# Altium project Genio350_DevKit.PrjPcb (part 1 of 3)
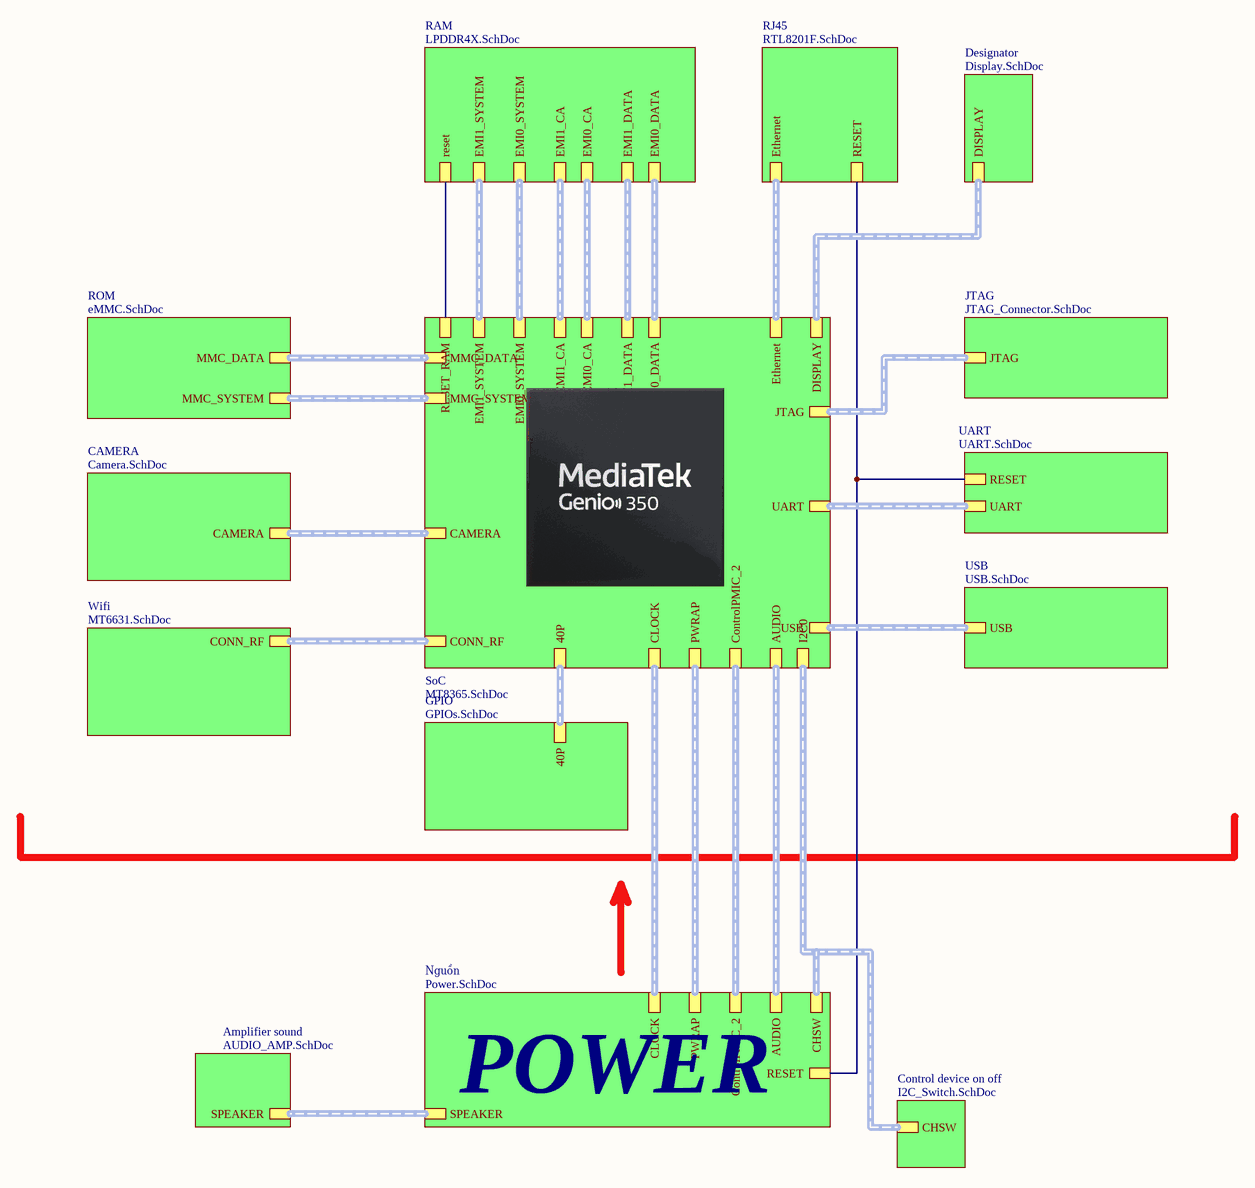
[diagram p0: main.SchDoc]
35 sheets, 543 parts. Net scope: hierarchical (ports join the sheet entries above them; power ports are global).
Board file: DevKit.PcbDoc
Sheets:
  main.SchDoc
    SoC = MT8365.SchDoc
      RAM = MT8365_LPDDR4X.SchDoc
      ROM, SD = MT8365_eMMC.SchDoc
      CAMERA = MT8365_Camera.SchDoc
      Connectivity = MT8365_CONN.SchDoc
      Ground = MT8365_Ground.SchDoc
      Power Soc = MT8365_Power.SchDoc
      Audio = MT8365_AUD.SchDoc
      Other = MT8365_Other.SchDoc
    RAM = LPDDR4X.SchDoc
      Channel A = LPDDR4X_Channel_A.SchDoc
      Channel B = LPDDR4X_Channel_B.SchDoc
      Power RAM = LPDDR4X_Power.SchDoc
      Ground = LPDDR4X_Ground.SchDoc
      Do Not Use = LPDDR4X_other.SchDoc
    ROM = eMMC.SchDoc
    Wifi = MT6631.SchDoc
    JTAG = JTAG_Connector.SchDoc
    UART = UART.SchDoc
    RJ45 = RTL8201F.SchDoc
    Nguồn = Power.SchDoc
      Power supply = Power_Supply.SchDoc
      BUCK = BUCK.SchDoc
      LDO = LDO.SchDoc
      AUD = AU.SchDoc
      RTC & Miscellaneous Features = RTC_Miscellaneous.SchDoc
      Control & Interface Signals = Control_Interface.SchDoc
      Charging and boost = Charger_boost_LDO.SchDoc
    CAMERA = Camera.SchDoc
    USB = USB.SchDoc
    GPIO = GPIOs.SchDoc
    Designator = Display.SchDoc
    Amplifier sound = AUDIO_AMP.SchDoc
    Control device on off = I2C_Switch.SchDoc

## Sheet main.SchDoc: Main Board Schematic
size A3; Author: Nguyễn Hữu Thắng; DrawnBy: Nguyễn Hữu Thắng; SheetNumber: 1; SheetTotal: 35; ENG_APP_DATE: --/--/--; DSN_APP_DATE: --/--/--; CHK_APP_DATE: --/--/--

### Sub-sheets
Amplifier sound = AUDIO_AMP.SchDoc: SPEAKER
CAMERA = Camera.SchDoc: CAMERA
Control device on off = I2C_Switch.SchDoc: CHSW
Designator = Display.SchDoc: DISPLAY
GPIO = GPIOs.SchDoc: 40P
JTAG = JTAG_Connector.SchDoc: JTAG
Nguồn = Power.SchDoc: PWRAP, ControlPMIC_2, CLOCK, AUDIO, CHSW, SPEAKER, RESET
RAM = LPDDR4X.SchDoc: EMI0_DATA, EMI1_DATA, EMI0_CA, EMI1_CA, EMI1_SYSTEM, EMI0_SYSTEM, reset
RJ45 = RTL8201F.SchDoc: Ethernet, RESET
ROM = eMMC.SchDoc: MMC_DATA, MMC_SYSTEM
SoC = MT8365.SchDoc: EMI0_DATA, EMI1_DATA, EMI0_CA, EMI1_CA, EMI0_SYSTEM, EMI1_SYSTEM, MMC_DATA, RESET_RAM, MMC_SYSTEM, PWRAP, ControlPMIC_2, CLOCK, CONN_RF, AUDIO, Ethernet, UART, USB, CAMERA, DISPLAY, 40P, I2C0, JTAG
UART = UART.SchDoc: UART, RESET
USB = USB.SchDoc: USB
Wifi = MT6631.SchDoc: CONN_RF

### Nets
reset: sheet UART/RESET, sheet RJ45/RESET, sheet Nguồn/RESET
NetU1#1_F14: sheet SoC/RESET_RAM, sheet RAM/reset

### Buses and harness runs
harness sheet Amplifier sound/SPEAKER = sheet Nguồn/SPEAKER
harness sheet CAMERA/CAMERA = sheet SoC/CAMERA
harness sheet Control device on off/CHSW = sheet Nguồn/CHSW = sheet SoC/I2C0
harness sheet Designator/DISPLAY = sheet SoC/DISPLAY
harness sheet GPIO/40P = sheet SoC/40P
harness sheet JTAG/JTAG = sheet SoC/JTAG
harness sheet Nguồn/AUDIO = sheet SoC/AUDIO
harness sheet Nguồn/CLOCK = sheet SoC/CLOCK
harness sheet Nguồn/ControlPMIC_2 = sheet SoC/ControlPMIC_2
harness sheet Nguồn/PWRAP = sheet SoC/PWRAP
harness sheet RAM/EMI0_CA = sheet SoC/EMI0_CA
harness sheet RAM/EMI0_DATA = sheet SoC/EMI0_DATA
harness sheet RAM/EMI0_SYSTEM = sheet SoC/EMI0_SYSTEM
harness sheet RAM/EMI1_CA = sheet SoC/EMI1_CA
harness sheet RAM/EMI1_DATA = sheet SoC/EMI1_DATA
harness sheet RAM/EMI1_SYSTEM = sheet SoC/EMI1_SYSTEM
harness sheet RJ45/Ethernet = sheet SoC/Ethernet
harness sheet ROM/MMC_DATA = sheet SoC/MMC_DATA
harness sheet ROM/MMC_SYSTEM = sheet SoC/MMC_SYSTEM
harness sheet SoC/CONN_RF = sheet Wifi/CONN_RF
harness sheet SoC/UART = sheet UART/UART
harness sheet SoC/USB = sheet USB/USB

### Notes on the sheet
- POWER
- THIS DOCUMENT AND THE DATA DISCLOSED HEREIN OR
- HEREWITH IS THE PROPERTY OF ALTIUM LIMITED AND MAY
- DWG NO:
- REVISION
- REV:
- DESCRIPTION
- DATE
- APPROVED
- BE FREELY DISTRIBUTED IN WHOLE. NO RIGHTS ARE
- RESERVED OR EXPRESS OR IMPLIED WARANTEE GIVEN.
- ENG:
- APPROVALS
- PROJECT
- DSN:
- CHK:
- REFERENCE DOCUMENTS
- PROJECT REVISION:
- TITLE
- DOCUMENT REVISION:
- DESIGN ITEM:
- BOM:
- FAB DWG:
- PCB DWG:
- ASSY DWG:
- SCALE:
- A3
- SIZE
- CAGE CODE
- FILE NAME
- DWG NO.
- SHEET
- OF
- REV

## Sheet MT8365.SchDoc
size A3; Author: Nguyễn Hữu Thắng; DrawnBy: Nguyễn Hữu Thắng; SheetNumber: 2; SheetTotal: 35
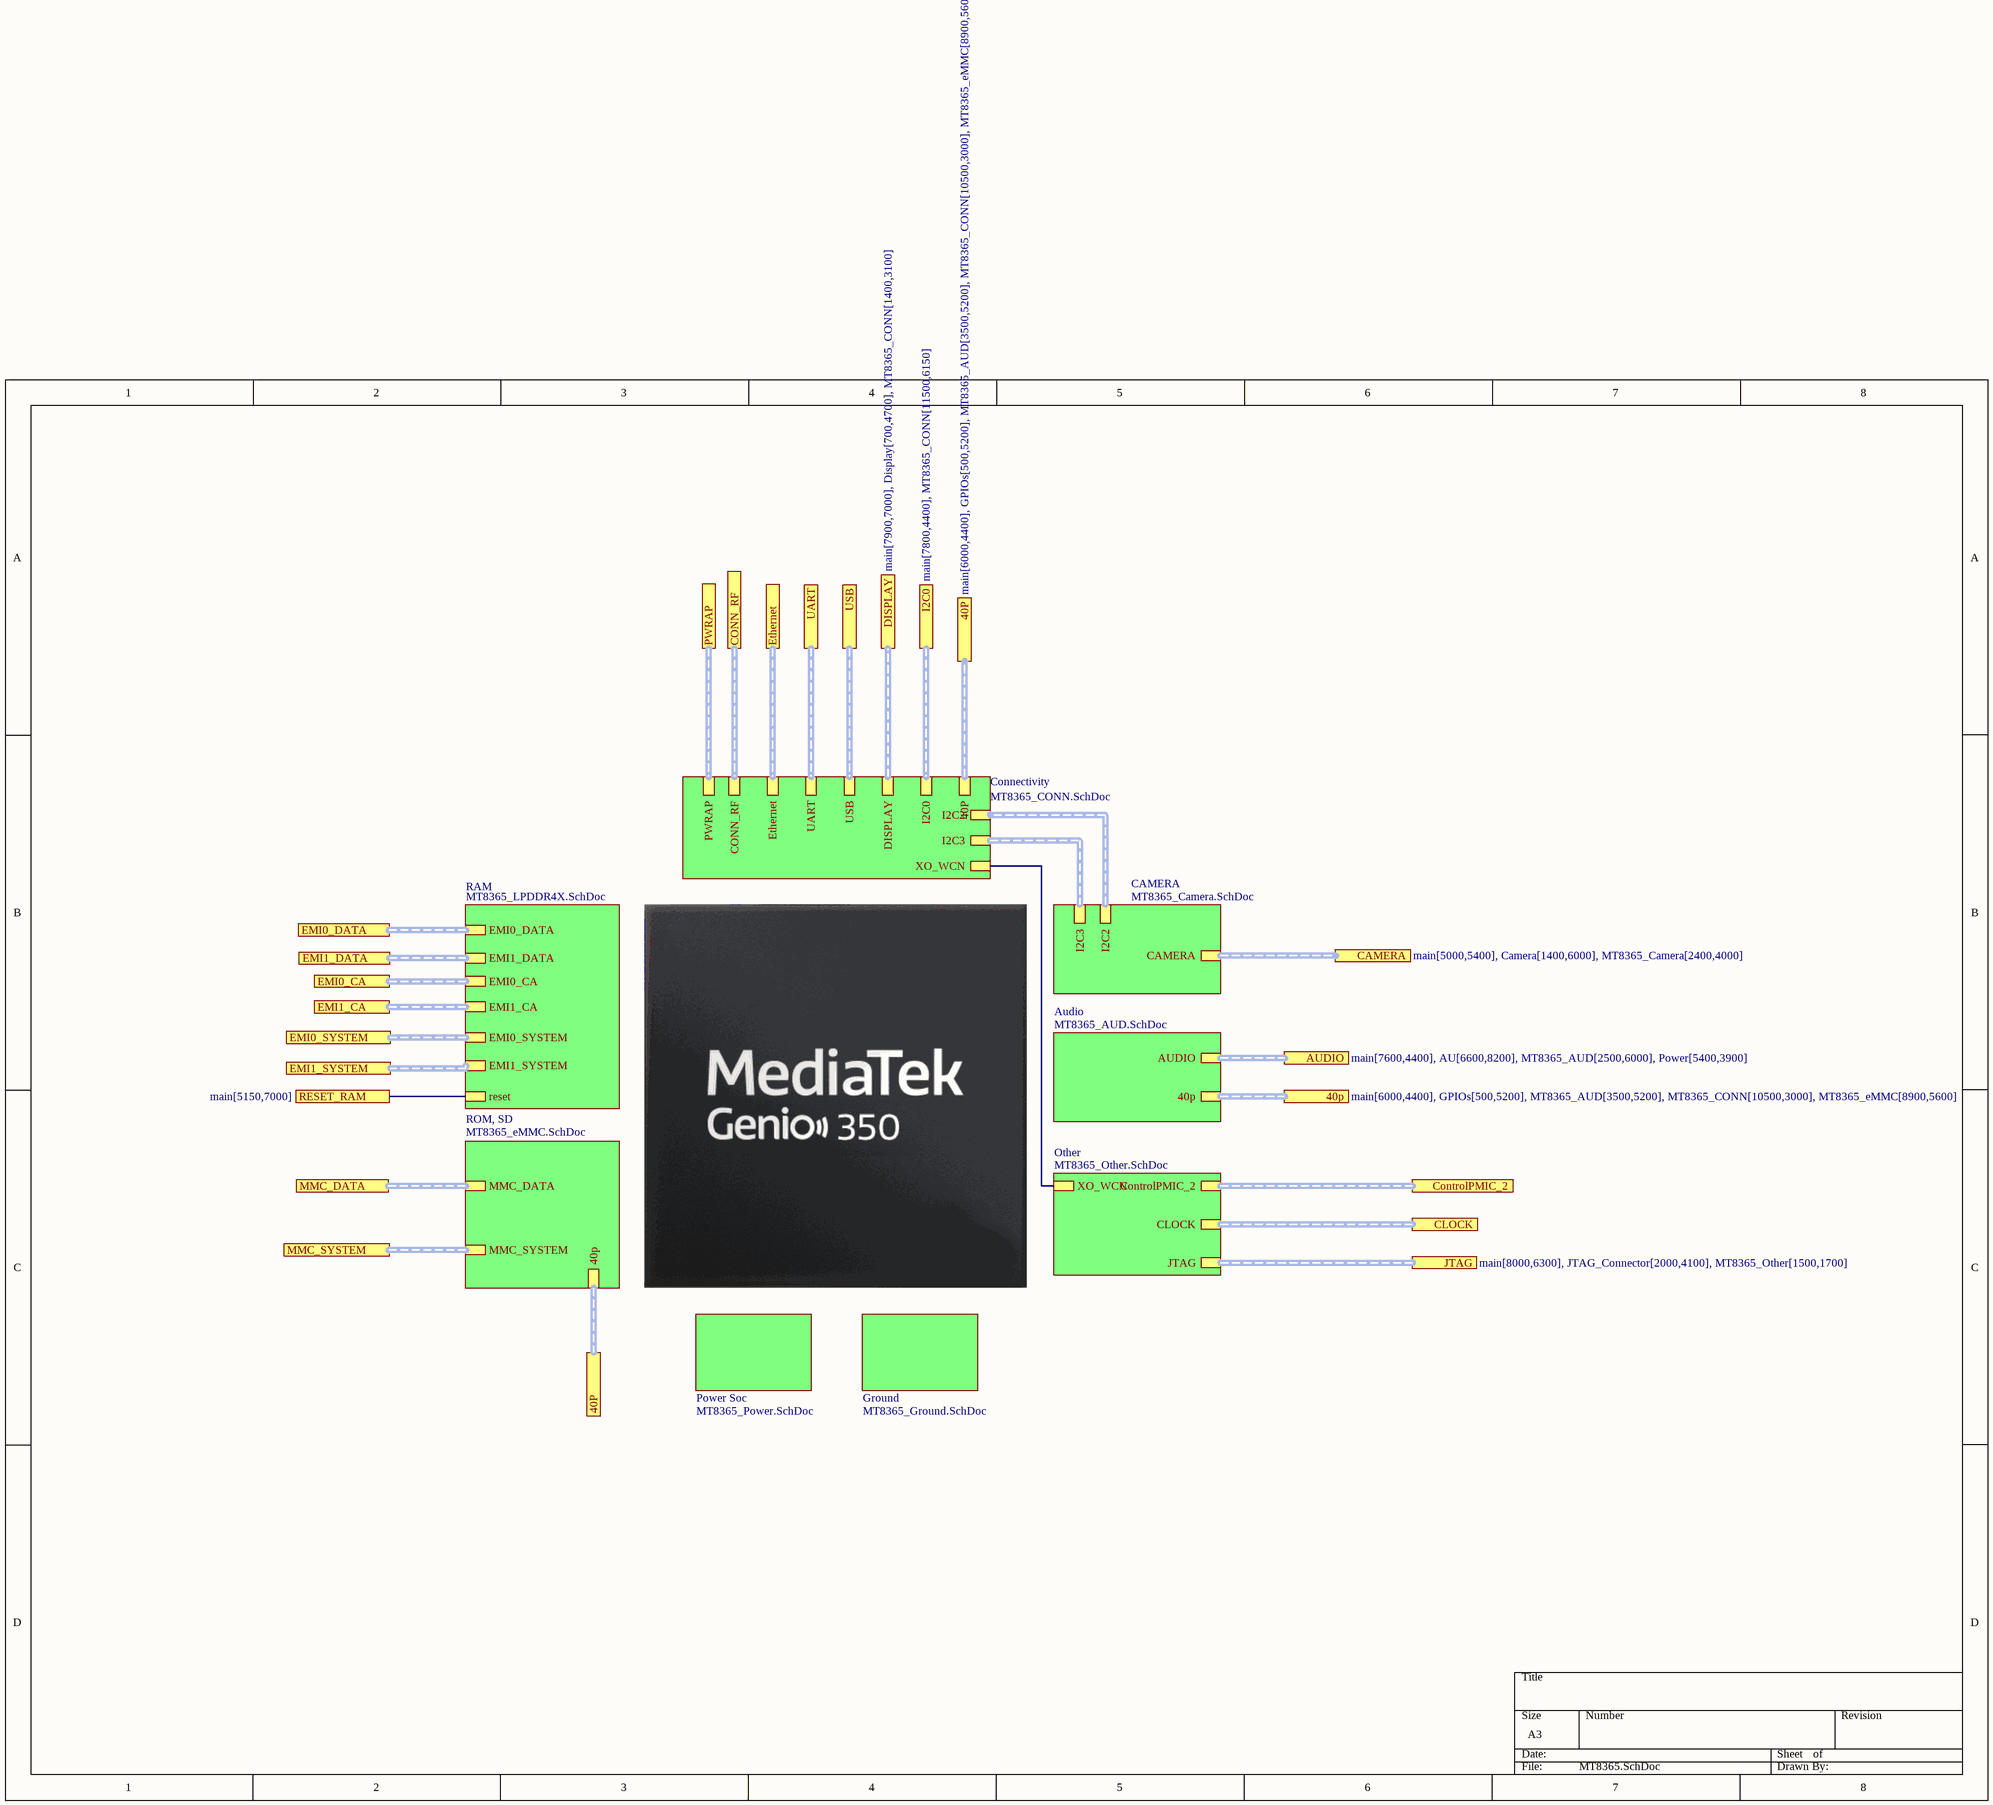
[diagram p1: MT8365.SchDoc]

### Sub-sheets
Audio = MT8365_AUD.SchDoc: AUDIO, 40p
CAMERA = MT8365_Camera.SchDoc: CAMERA, I2C3, I2C2
Connectivity = MT8365_CONN.SchDoc: PWRAP, XO_WCN, CONN_RF, Ethernet, UART, USB, I2C3, I2C2, DISPLAY, 40P, I2C0
Ground = MT8365_Ground.SchDoc: no entries
Other = MT8365_Other.SchDoc: ControlPMIC_2, CLOCK, XO_WCN, JTAG
Power Soc = MT8365_Power.SchDoc: no entries
RAM = MT8365_LPDDR4X.SchDoc: EMI0_DATA, EMI1_DATA, EMI0_CA, EMI1_CA, EMI1_SYSTEM, EMI0_SYSTEM, reset
ROM, SD = MT8365_eMMC.SchDoc: MMC_DATA, MMC_SYSTEM, 40p

### Ports
40P (harness 40p, see main[6000,4400], GPIOs[500,5200], MT8365_AUD[3500,5200], MT8365_CONN[10500,3000], MT8365_eMMC[8900,5600]), 40p (see main[6000,4400], GPIOs[500,5200], MT8365_AUD[3500,5200], MT8365_CONN[10500,3000], MT8365_eMMC[8900,5600]), AUDIO (see main[7600,4400], AU[6600,8200], MT8365_AUD[2500,6000], Power[5400,3900]), CAMERA (see main[5000,5400], Camera[1400,6000], MT8365_Camera[2400,4000]), CLOCK (see main[6700,4400], MT8365_Other[1500,5800], Power[11000,5700], RTC_Miscellaneous[2500,1800]), CONN_RF (see main[5000,4600], MT6631[10400,3000], MT8365_CONN[700,7400]), ControlPMIC_2 (see main[7300,4400], Control_Interface[3100,2200], MT8365_Other[1000,3700], Power[9700,9000]), DISPLAY (see main[7900,7000], Display[700,4700], MT8365_CONN[1400,3100]), EMI0_CA (see main[6200,7000], LPDDR4X[7000,9400], LPDDR4X_Channel_A[2700,5600], MT8365_LPDDR4X[7500,5500]), EMI0_DATA (see main[6700,7000], LPDDR4X[7000,9820], LPDDR4X_Channel_A[8000,5200], MT8365_LPDDR4X[7800,9200]), EMI0_SYSTEM (see main[5700,7000], LPDDR4X[7000,8860], LPDDR4X_Channel_A[7000,2300], MT8365_LPDDR4X[8200,3000]), EMI1_CA (see main[6000,7000], LPDDR4X[7020,7400], LPDDR4X_Channel_B[2700,5600], MT8365_LPDDR4X[7500,4500]), EMI1_DATA (see main[6500,7000], LPDDR4X[7000,7900], LPDDR4X_Channel_B[8000,5200], MT8365_LPDDR4X[7800,7200]), EMI1_SYSTEM (see main[5400,7000], LPDDR4X[7000,6900], LPDDR4X_Channel_B[7500,1700], MT8365_LPDDR4X[8200,1300]), Ethernet (see main[7600,7000], MT8365_CONN[13494.004,8500], RTL8201F[9500,2400]), I2C0 (see main[7800,4400], MT8365_CONN[11500,6150]), JTAG (see main[8000,6300], JTAG_Connector[2000,4100], MT8365_Other[1500,1700]), MMC_DATA (see main[5000,6700], eMMC[6000,4540], MT8365_eMMC[1884.259,5540]), MMC_SYSTEM (see main[5000,6400], eMMC[5900,3640], MT8365_eMMC[2879.674,1840]), PWRAP (see main[7000,4400], Control_Interface[3900,4400], MT8365_CONN[4500,8700], Power[9100,9000]), RESET_RAM (see main[5150,7000]), UART (see main[8000,5600], MT8365_CONN[11800,6800], UART[1600,5800]), USB (see main[8000,4700], MT8365_CONN[2500,5900], USB[700,4700])

### Nets
XO_IN: sheet Connectivity/XO_WCN, sheet Other/XO_WCN
NetU1#1_F14: port RESET_RAM, sheet RAM/reset

### Buses and harness runs
harness port 40p = sheet Audio/40p
harness port 40P = sheet Connectivity/40P
harness port 40P = sheet ROM, SD/40p
harness port AUDIO = sheet Audio/AUDIO
harness port CAMERA = sheet CAMERA/CAMERA
harness port CLOCK = sheet Other/CLOCK
harness port CONN_RF = sheet Connectivity/CONN_RF
harness port ControlPMIC_2 = sheet Other/ControlPMIC_2
harness port DISPLAY = sheet Connectivity/DISPLAY
harness port EMI0_CA = sheet RAM/EMI0_CA
harness port EMI0_DATA = sheet RAM/EMI0_DATA
harness port EMI0_SYSTEM = sheet RAM/EMI0_SYSTEM
harness port EMI1_CA = sheet RAM/EMI1_CA
harness port EMI1_DATA = sheet RAM/EMI1_DATA
harness port EMI1_SYSTEM = sheet RAM/EMI1_SYSTEM
harness port Ethernet = sheet Connectivity/Ethernet
harness port I2C0 = sheet Connectivity/I2C0
harness port JTAG = sheet Other/JTAG
harness port MMC_DATA = sheet ROM, SD/MMC_DATA
harness port MMC_SYSTEM = sheet ROM, SD/MMC_SYSTEM
harness port PWRAP = sheet Connectivity/PWRAP
harness port UART = sheet Connectivity/UART
harness port USB = sheet Connectivity/USB
harness sheet CAMERA/I2C2 = sheet Connectivity/I2C2
harness sheet CAMERA/I2C3 = sheet Connectivity/I2C3

## Sheet MT8365_LPDDR4X.SchDoc
size A3; SheetNumber: 4; SheetTotal: 35
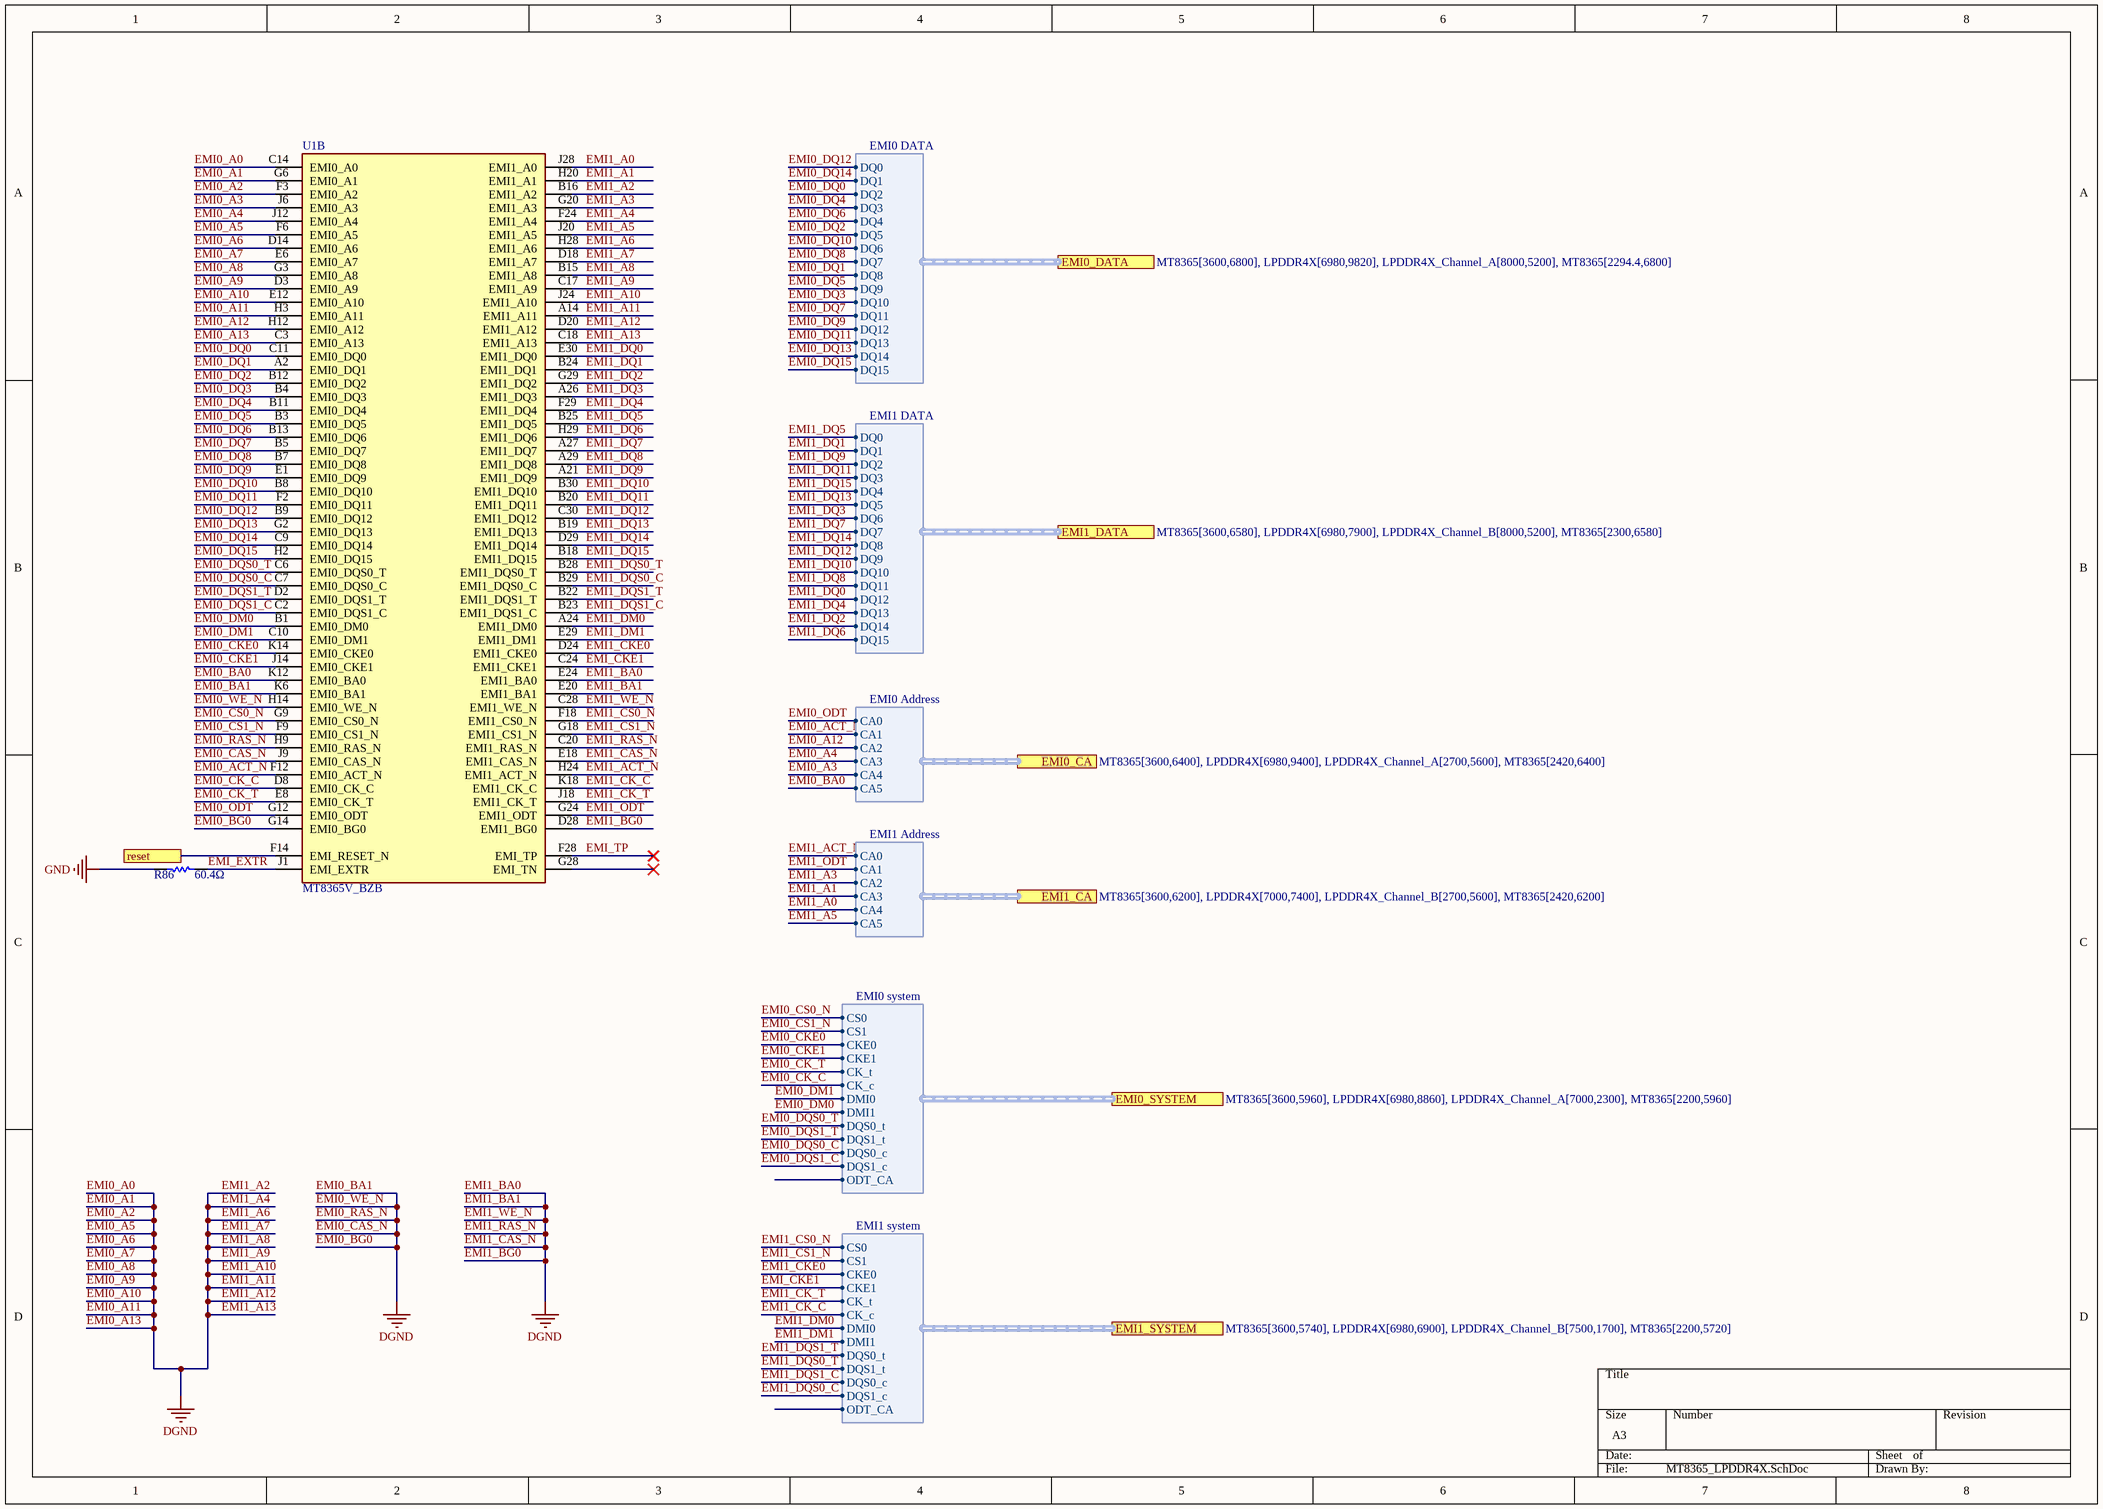
[diagram p2: MT8365_LPDDR4X.SchDoc]

### Parts
(Parts that share a designator on the sheet are numbered #1, #2 ... from top to bottom, then left to right.)
R86  value 60.4Ω  [R0603]  (hidden comment: R0603)
U1#1  MT8365V_BZB  [BGA633C40P30X29_1220X1180X90]  (part B of 11)

### Ports
EMI0_CA (harness EMI0 Address, see MT8365[3600,6400], LPDDR4X[6980,9400], LPDDR4X_Channel_A[2700,5600], MT8365[2420,6400]), EMI0_DATA (harness EMI0 DATA, see MT8365[3600,6800], LPDDR4X[6980,9820], LPDDR4X_Channel_A[8000,5200], MT8365[2294.4,6800]), EMI0_SYSTEM (harness EMI0 system, see MT8365[3600,5960], LPDDR4X[6980,8860], LPDDR4X_Channel_A[7000,2300], MT8365[2200,5960]), EMI1_CA (harness EMI1 Address, see MT8365[3600,6200], LPDDR4X[7000,7400], LPDDR4X_Channel_B[2700,5600], MT8365[2420,6200]), EMI1_DATA (harness EMI1 DATA, see MT8365[3600,6580], LPDDR4X[6980,7900], LPDDR4X_Channel_B[8000,5200], MT8365[2300,6580]), EMI1_SYSTEM (harness EMI1 system, see MT8365[3600,5740], LPDDR4X[6980,6900], LPDDR4X_Channel_B[7500,1700], MT8365[2200,5720]), reset (see MT8365[3600,5500], LPDDR4X[6980,2000], LPDDR4X_other[4080,4900])

### Harnesses
EMI0 DATA: DQ0, DQ1, DQ2, DQ3, DQ4, DQ5, DQ6, DQ7, DQ8, DQ9, DQ10, DQ11, DQ12, DQ13, DQ14, DQ15
EMI1 DATA: DQ0, DQ1, DQ2, DQ3, DQ4, DQ5, DQ6, DQ7, DQ8, DQ9, DQ10, DQ11, DQ12, DQ13, DQ14, DQ15
EMI0 Address: CA0, CA1, CA2, CA3, CA4, CA5
EMI1 Address: CA0, CA1, CA2, CA3, CA4, CA5
EMI0 system: CS0, CS1, CKE0, CKE1, CK_t, CK_c, DMI0, DMI1, DQS0_t, DQS1_t, DQS0_c, DQS1_c, ODT_CA
EMI1 system: CS0, CS1, CKE0, CKE1, CK_t, CK_c, DMI0, DMI1, DQS0_t, DQS1_t, DQS0_c, DQS1_c, ODT_CA

### Nets
EMI0_A0: U1#1.A14(EMI1_A11) U1#1.B15(EMI1_A8) U1#1.B16(EMI1_A2) U1#1.C3(EMI0_A13) U1#1.C14(EMI0_A0) U1#1.C17(EMI1_A9) U1#1.C18(EMI1_A13) U1#1.C20(EMI1_RAS_N) U1#1.C28(EMI1_WE_N) U1#1.D3(EMI0_A9) U1#1.D14(EMI0_A6) U1#1.D18(EMI1_A7) U1#1.D20(EMI1_A12) U1#1.D28(EMI1_BG0) U1#1.E6(EMI0_A7) U1#1.E12(EMI0_A10) U1#1.E18(EMI1_CAS_N) U1#1.E20(EMI1_BA1) U1#1.E24(EMI1_BA0) U1#1.F3(EMI0_A2) U1#1.F6(EMI0_A5) U1#1.F24(EMI1_A4) U1#1.G3(EMI0_A8) U1#1.G6(EMI0_A1) U1#1.G14(EMI0_BG0) U1#1.H3(EMI0_A11) U1#1.H9(EMI0_RAS_N) U1#1.H14(EMI0_WE_N) U1#1.H28(EMI1_A6) U1#1.J9(EMI0_CAS_N) U1#1.J24(EMI1_A10) U1#1.K6(EMI0_BA1)  [also labelled DGND, EMI0_A1, EMI0_A10, EMI0_A11, EMI0_A13, EMI0_A2, EMI0_A5, EMI0_A6, EMI0_A7, EMI0_A8, EMI0_A9, EMI0_BA1, EMI0_BG0, EMI0_CAS_N, EMI0_RAS_N, EMI0_WE_N, EMI1_A10, EMI1_A11, EMI1_A12, EMI1_A13, EMI1_A2, EMI1_A4, EMI1_A6, EMI1_A7, EMI1_A8, EMI1_A9, EMI1_BA0, EMI1_BA1, EMI1_BG0, EMI1_CAS_N, EMI1_RAS_N, EMI1_WE_N]
GND: R86.2
ODT_CA_a: port EMI0_SYSTEM.ODT_CA, port EMI1_SYSTEM.ODT_CA
EMI0_A3: U1#1.J6(EMI0_A3) ; port EMI0_CA.CA4
EMI0_A4: U1#1.J12(EMI0_A4) ; port EMI0_CA.CA3
EMI0_A12: U1#1.H12(EMI0_A12) ; port EMI0_CA.CA2
EMI0_ACT_N: U1#1.F12(EMI0_ACT_N) ; port EMI0_CA.CA1
EMI0_BA0: U1#1.K12(EMI0_BA0) ; port EMI0_CA.CA5
EMI0_CK_C: U1#1.D8(EMI0_CK_C) ; port EMI0_SYSTEM.CK_c  [project net CK_c_a]
EMI0_CK_T: U1#1.E8(EMI0_CK_T) ; port EMI0_SYSTEM.CK_t  [project net CK_t_a]
EMI0_CKE0: U1#1.K14(EMI0_CKE0) ; port EMI0_SYSTEM.CKE0  [project net CKE0_a]
EMI0_CKE1: U1#1.J14(EMI0_CKE1) ; port EMI0_SYSTEM.CKE1  [project net CKE1_a]
EMI0_CS0_N: U1#1.G9(EMI0_CS0_N) ; port EMI0_SYSTEM.CS0  [project net CS0_a]
EMI0_CS1_N: U1#1.F9(EMI0_CS1_N) ; port EMI0_SYSTEM.CS1  [project net CS1_a]
EMI0_DM0: U1#1.B1(EMI0_DM0) ; port EMI0_SYSTEM.DMI1  [project net DMI1_a]
EMI0_DM1: U1#1.C10(EMI0_DM1) ; port EMI0_SYSTEM.DMI0  [project net DMI0_a]
EMI0_DQ0: U1#1.C11(EMI0_DQ0) ; port EMI0_DATA.DQ2
EMI0_DQ1: U1#1.A2(EMI0_DQ1) ; port EMI0_DATA.DQ8
EMI0_DQ2: U1#1.B12(EMI0_DQ2) ; port EMI0_DATA.DQ5
EMI0_DQ3: U1#1.B4(EMI0_DQ3) ; port EMI0_DATA.DQ10
EMI0_DQ4: U1#1.B11(EMI0_DQ4) ; port EMI0_DATA.DQ3
EMI0_DQ5: U1#1.B3(EMI0_DQ5) ; port EMI0_DATA.DQ9
EMI0_DQ6: U1#1.B13(EMI0_DQ6) ; port EMI0_DATA.DQ4
EMI0_DQ7: U1#1.B5(EMI0_DQ7) ; port EMI0_DATA.DQ11
EMI0_DQ8: U1#1.B7(EMI0_DQ8) ; port EMI0_DATA.DQ7
EMI0_DQ9: U1#1.E1(EMI0_DQ9) ; port EMI0_DATA.DQ12
EMI0_DQ10: U1#1.B8(EMI0_DQ10) ; port EMI0_DATA.DQ6
EMI0_DQ11: U1#1.F2(EMI0_DQ11) ; port EMI0_DATA.DQ13
EMI0_DQ12: U1#1.B9(EMI0_DQ12) ; port EMI0_DATA.DQ0
EMI0_DQ13: U1#1.G2(EMI0_DQ13) ; port EMI0_DATA.DQ14
EMI0_DQ14: U1#1.C9(EMI0_DQ14) ; port EMI0_DATA.DQ1
EMI0_DQ15: U1#1.H2(EMI0_DQ15) ; port EMI0_DATA.DQ15
EMI0_DQS0_C: U1#1.C7(EMI0_DQS0_C) ; port EMI0_SYSTEM.DQS0_c  [project net DQS0_c_a]
EMI0_DQS0_T: U1#1.C6(EMI0_DQS0_T) ; port EMI0_SYSTEM.DQS0_t  [project net DQS0_t_a]
EMI0_DQS1_C: U1#1.C2(EMI0_DQS1_C) ; port EMI0_SYSTEM.DQS1_c  [project net DQS1_c_a]
EMI0_DQS1_T: U1#1.D2(EMI0_DQS1_T) ; port EMI0_SYSTEM.DQS1_t  [project net DQS1_t_a]
EMI0_ODT: U1#1.G12(EMI0_ODT) ; port EMI0_CA.CA0
EMI1_A0: U1#1.J28(EMI1_A0) ; port EMI1_CA.CA4
EMI1_A1: U1#1.H20(EMI1_A1) ; port EMI1_CA.CA3
EMI1_A3: U1#1.G20(EMI1_A3) ; port EMI1_CA.CA2
EMI1_A5: U1#1.J20(EMI1_A5) ; port EMI1_CA.CA5
EMI1_ACT_N: U1#1.H24(EMI1_ACT_N) ; port EMI1_CA.CA0
EMI1_CK_C: U1#1.K18(EMI1_CK_C) ; port EMI1_SYSTEM.CK_c  [project net CK_c_b]
EMI1_CK_T: U1#1.J18(EMI1_CK_T) ; port EMI1_SYSTEM.CK_t  [project net CK_t_b]
EMI1_CKE0: U1#1.D24(EMI1_CKE0) ; port EMI1_SYSTEM.CKE0  [project net CKE0_b]
EMI1_CS0_N: U1#1.F18(EMI1_CS0_N) ; port EMI1_SYSTEM.CS0  [project net CS0_b]
EMI1_CS1_N: U1#1.G18(EMI1_CS1_N) ; port EMI1_SYSTEM.CS1  [project net CS1_b]
EMI1_DM0: U1#1.A24(EMI1_DM0) ; port EMI1_SYSTEM.DMI0  [project net DMI0_b]
EMI1_DM1: U1#1.E29(EMI1_DM1) ; port EMI1_SYSTEM.DMI1  [project net DMI1_b]
EMI1_DQ0: U1#1.E30(EMI1_DQ0) ; port EMI1_DATA.DQ12
EMI1_DQ1: U1#1.B24(EMI1_DQ1) ; port EMI1_DATA.DQ1
EMI1_DQ2: U1#1.G29(EMI1_DQ2) ; port EMI1_DATA.DQ14
EMI1_DQ3: U1#1.A26(EMI1_DQ3) ; port EMI1_DATA.DQ6
EMI1_DQ4: U1#1.F29(EMI1_DQ4) ; port EMI1_DATA.DQ13
EMI1_DQ5: U1#1.B25(EMI1_DQ5) ; port EMI1_DATA.DQ0
EMI1_DQ6: U1#1.H29(EMI1_DQ6) ; port EMI1_DATA.DQ15
EMI1_DQ7: U1#1.A27(EMI1_DQ7) ; port EMI1_DATA.DQ7
EMI1_DQ8: U1#1.A29(EMI1_DQ8) ; port EMI1_DATA.DQ11
EMI1_DQ9: U1#1.A21(EMI1_DQ9) ; port EMI1_DATA.DQ2
EMI1_DQ10: U1#1.B30(EMI1_DQ10) ; port EMI1_DATA.DQ10
EMI1_DQ11: U1#1.B20(EMI1_DQ11) ; port EMI1_DATA.DQ3
EMI1_DQ12: U1#1.C30(EMI1_DQ12) ; port EMI1_DATA.DQ9
EMI1_DQ13: U1#1.B19(EMI1_DQ13) ; port EMI1_DATA.DQ5
EMI1_DQ14: U1#1.D29(EMI1_DQ14) ; port EMI1_DATA.DQ8
EMI1_DQ15: U1#1.B18(EMI1_DQ15) ; port EMI1_DATA.DQ4
EMI1_DQS0_C: U1#1.B29(EMI1_DQS0_C) ; port EMI1_SYSTEM.DQS1_c  [project net DQS1_c_b]
EMI1_DQS0_T: U1#1.B28(EMI1_DQS0_T) ; port EMI1_SYSTEM.DQS1_t  [project net DQS1_t_b]
EMI1_DQS1_C: U1#1.B23(EMI1_DQS1_C) ; port EMI1_SYSTEM.DQS0_c  [project net DQS0_c_b]
EMI1_DQS1_T: U1#1.B22(EMI1_DQS1_T) ; port EMI1_SYSTEM.DQS0_t  [project net DQS0_t_b]
EMI1_ODT: U1#1.G24(EMI1_ODT) ; port EMI1_CA.CA1
EMI_CKE1: U1#1.C24(EMI1_CKE1) ; port EMI1_SYSTEM.CKE1  [project net CKE1_b]
EMI_EXTR: R86.1 U1#1.J1(EMI_EXTR)
EMI_TP: U1#1.F28(EMI_TP)
NetU1#1_F14: U1#1.F14(EMI_RESET_N) ; port reset

Not connected (* = marked no-connect by the designer): U1#1 G28(EMI_TN)*

### Library data of the parts
U1#1 = MT8365V_BZB: Integrated Circuit; Manufacturer_Name: Mediatek; Manufacturer_Part_Number: MT8365V/BZB; Datasheet Link: https://www.mouser.co.uk/datasheet/2/1074/MT8365_AIoT_Application_Processor_Datasheet_v1_0_2-3106631.pdf; Height: 0.9mm; Mouser Part Number: 840-MT8365V/BZB; Mouser Price/Stock: https://www.mouser.co.uk/ProductDetail/MediaTek/MT8365V-BZB?qs=Jm2GQyTW%2FbjcedX9ugwNWQ%3D%3D

## Sheet MT8365_eMMC.SchDoc
size A4; SheetNumber: 5; SheetTotal: 35
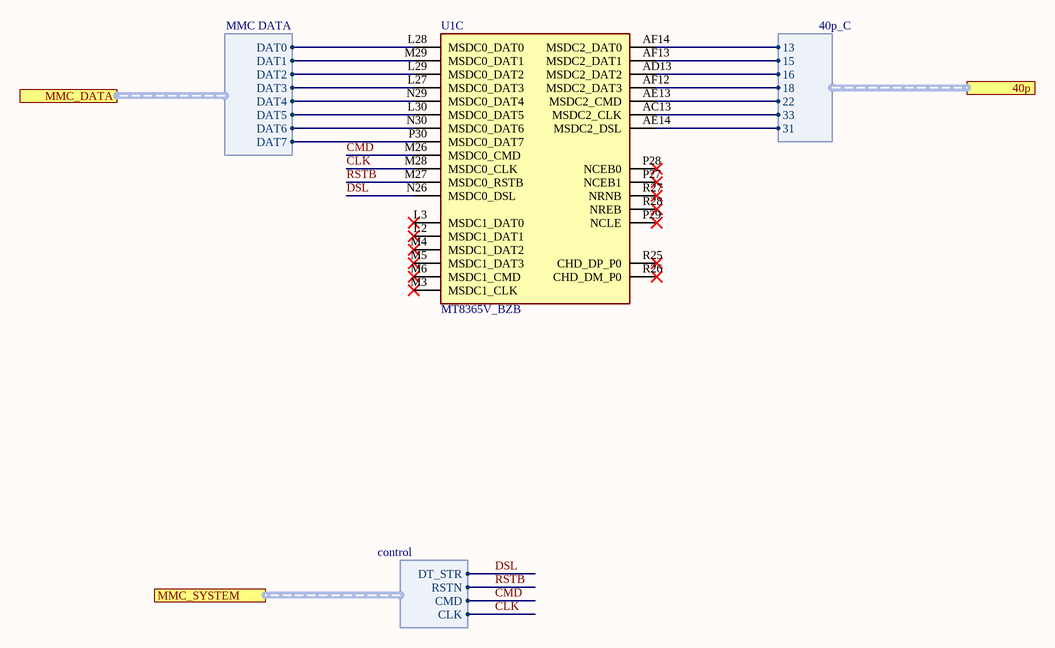
[diagram p3: MT8365_eMMC.SchDoc]

### Parts
(Parts that share a designator on the sheet are numbered #1, #2 ... from top to bottom, then left to right.)
U1#2  MT8365V_BZB  [BGA633C40P30X29_1220X1180X90]  (part C of 10)

### Ports
40p (harness 40p_C, see MT8365[4600,4000], GPIOs[500,5200], MT8365[4600,3000], MT8365[7500,8900], MT8365[10000,5500], MT8365_AUD[3500,5200], MT8365_CONN[10500,3000]), MMC_DATA (harness MMC DATA, see MT8365[3600,4800], eMMC[6000,4540], MT8365[2280,4800]), MMC_SYSTEM (harness control, see MT8365[3600,4300], eMMC[5900,3640], MT8365[2180,4300])

### Harnesses
MMC DATA: DAT0, DAT1, DAT2, DAT3, DAT4, DAT5, DAT6, DAT7
control: DT_STR, RSTN, CMD, CLK
40p_C: 15, 16, 18, 22, 13, 33, 31

### Nets
CLK: U1#2.M28(MSDC0_CLK) ; port MMC_SYSTEM.CLK
CMD: U1#2.M26(MSDC0_CMD) ; port MMC_SYSTEM.CMD
DSL: U1#2.N26(MSDC0_DSL) ; port MMC_SYSTEM.DT_STR
RSTB: U1#2.M27(MSDC0_RSTB) ; port MMC_SYSTEM.RSTN
NetIC3_A3: U1#2.L28(MSDC0_DAT0) ; port MMC_DATA.DAT0
NetIC3_A4: U1#2.M29(MSDC0_DAT1) ; port MMC_DATA.DAT1
NetIC3_A5: U1#2.L29(MSDC0_DAT2) ; port MMC_DATA.DAT2
NetIC3_B2: U1#2.L27(MSDC0_DAT3) ; port MMC_DATA.DAT3
NetIC3_B3: U1#2.N29(MSDC0_DAT4) ; port MMC_DATA.DAT4
NetIC3_B4: U1#2.L30(MSDC0_DAT5) ; port MMC_DATA.DAT5
NetIC3_B5: U1#2.N30(MSDC0_DAT6) ; port MMC_DATA.DAT6
NetIC3_B6: U1#2.P30(MSDC0_DAT7) ; port MMC_DATA.DAT7
NetU1#2_AC13: U1#2.AC13(MSDC2_CLK) ; port 40p.33
NetU1#2_AD13: U1#2.AD13(MSDC2_DAT2) ; port 40p.16
NetU1#2_AE13: U1#2.AE13(MSDC2_CMD) ; port 40p.22
NetU1#2_AE14: U1#2.AE14(MSDC2_DSL) ; port 40p.31
NetU1#2_AF12: U1#2.AF12(MSDC2_DAT3) ; port 40p.18
NetU1#2_AF13: U1#2.AF13(MSDC2_DAT1) ; port 40p.15
NetU1#2_AF14: U1#2.AF14(MSDC2_DAT0) ; port 40p.13

Not connected (* = marked no-connect by the designer): U1#2 L2(MSDC1_DAT1)* L3(MSDC1_DAT0)* M3(MSDC1_CLK)* M4(MSDC1_DAT2)* M5(MSDC1_DAT3)* M6(MSDC1_CMD)* P27(NCEB1)* P28(NCEB0)* P29(NCLE)* R25(CHD_DP_P0)* R26(CHD_DM_P0)* R27(NRNB)* R28(NREB)*

### Library data of the parts
U1#2 = MT8365V_BZB: SoC; Manufacturer_Name: Mediatek; Manufacturer_Part_Number: MT8365V/BZB; Datasheet Link: https://www.mouser.co.uk/datasheet/2/1074/MT8365_AIoT_Application_Processor_Datasheet_v1_0_2-3106631.pdf; Height: 0.9mm; Mouser Part Number: 840-MT8365V/BZB; Mouser Price/Stock: https://www.mouser.co.uk/ProductDetail/MediaTek/MT8365V-BZB?qs=Jm2GQyTW%2FbjcedX9ugwNWQ%3D%3D

## Sheet MT8365_Camera.SchDoc
size A4; SheetNumber: 6; SheetTotal: 36
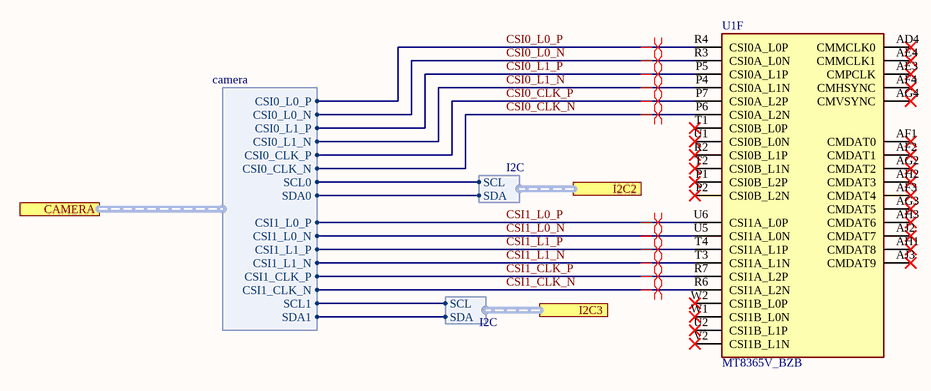
[diagram p4: MT8365_Camera.SchDoc]

### Parts
(Parts that share a designator on the sheet are numbered #1, #2 ... from top to bottom, then left to right.)
U1#1  MT8365V_BZB  [BGA633C40P30X29_1220X1180X90]  (part F of 11)

### Ports
CAMERA (harness camera, see MT8365[9500,6600], Camera[1400,6000], MT8365[10400,6600]), I2C2 (harness I2C, see MT8365[8600,7000], MT8365_CONN[11500,5750]), I2C3 (harness I2C, see MT8365[8400,7000], MT8365_CONN[11500,5550])

### Harnesses
camera: CSI0_L0_P, CSI0_L0_N, CSI0_L1_P, CSI0_L1_N, CSI0_CLK_P, CSI0_CLK_N, CSI1_L0_P, CSI1_L0_N, CSI1_L1_P, CSI1_L1_N, CSI1_CLK_P, CSI1_CLK_N, SCL0, SDA0, SCL1, SDA1
I2C: SCL, SDA

### Nets
27: port CAMERA.SDA1, port I2C3.SDA
28: port CAMERA.SCL1, port I2C3.SCL
CSI0_CLK_N: U1#1.P6(CSI0A_L2N) ; port CAMERA.CSI0_CLK_N
CSI0_CLK_P: U1#1.P7(CSI0A_L2P) ; port CAMERA.CSI0_CLK_P
CSI0_L0_N: U1#1.R3(CSI0A_L0N) ; port CAMERA.CSI0_L0_N
CSI0_L0_P: U1#1.R4(CSI0A_L0P) ; port CAMERA.CSI0_L0_P
CSI0_L1_N: U1#1.P4(CSI0A_L1N) ; port CAMERA.CSI0_L1_N
CSI0_L1_P: U1#1.P5(CSI0A_L1P) ; port CAMERA.CSI0_L1_P
CSI1_CLK_N: U1#1.R6(CSI1A_L2N) ; port CAMERA.CSI1_CLK_N
CSI1_CLK_P: U1#1.R7(CSI1A_L2P) ; port CAMERA.CSI1_CLK_P
CSI1_L0_N: U1#1.U5(CSI1A_L0N) ; port CAMERA.CSI1_L0_N
CSI1_L0_P: U1#1.U6(CSI1A_L0P) ; port CAMERA.CSI1_L0_P
CSI1_L1_N: U1#1.T3(CSI1A_L1N) ; port CAMERA.CSI1_L1_N
CSI1_L1_P: U1#1.T4(CSI1A_L1P) ; port CAMERA.CSI1_L1_P
NetU1#2_AH4: port CAMERA.SCL0, port I2C2.SCL
NetU1#2_AJ4: port CAMERA.SDA0, port I2C2.SDA

Not connected (* = marked no-connect by the designer): U1#1 AD4(CMMCLK0)* AE3(CMPCLK)* AE4(CMMCLK1)* AF1(CMDAT0)* AF2(CMDAT1)* AF3(CMDAT4)* AF4(CMHSYNC)* AG2(CMDAT2)* AG3(CMDAT5)* AG4(CMVSYNC)* AH1(CMDAT8)* AH2(CMDAT3)* AH3(CMDAT6)* AJ2(CMDAT7)* AJ3(CMDAT9)* P1(CSI0B_L2P)* P2(CSI0B_L2N)* R2(CSI0B_L1P)* T1(CSI0B_L0P)* T2(CSI0B_L1N)* U1(CSI0B_L0N)* U2(CSI1B_L1P)* V2(CSI1B_L1N)* W1(CSI1B_L0N)* W2(CSI1B_L0P)*

### Layout directives
differential pair: CSI0_CLK_N, CSI0_CLK_P, CSI0_L0_N, CSI0_L0_P, CSI0_L1_N, CSI0_L1_P, CSI1_CLK_N, CSI1_CLK_P, CSI1_L0_N, CSI1_L0_P, CSI1_L1_N, CSI1_L1_P

### Library data of the parts
U1#1 = MT8365V_BZB: as U1#2 on sheet MT8365_eMMC; Datasheet Link: https://www.mouser.co.uk/datasheet/2/1074/MT8365_AIoT_Application_Processor_Datasheet_v1_0_2-3106631.pdf; Height: 0.9mm; Mouser Part Number: 840-MT8365V/BZB; Mouser Price/Stock: https://www.mouser.co.uk/ProductDetail/MediaTek/MT8365V-BZB?qs=Jm2GQyTW%2FbjcedX9ugwNWQ%3D%3D

## Sheet MT8365_CONN.SchDoc
size A3; SheetNumber: 8; SheetTotal: 35
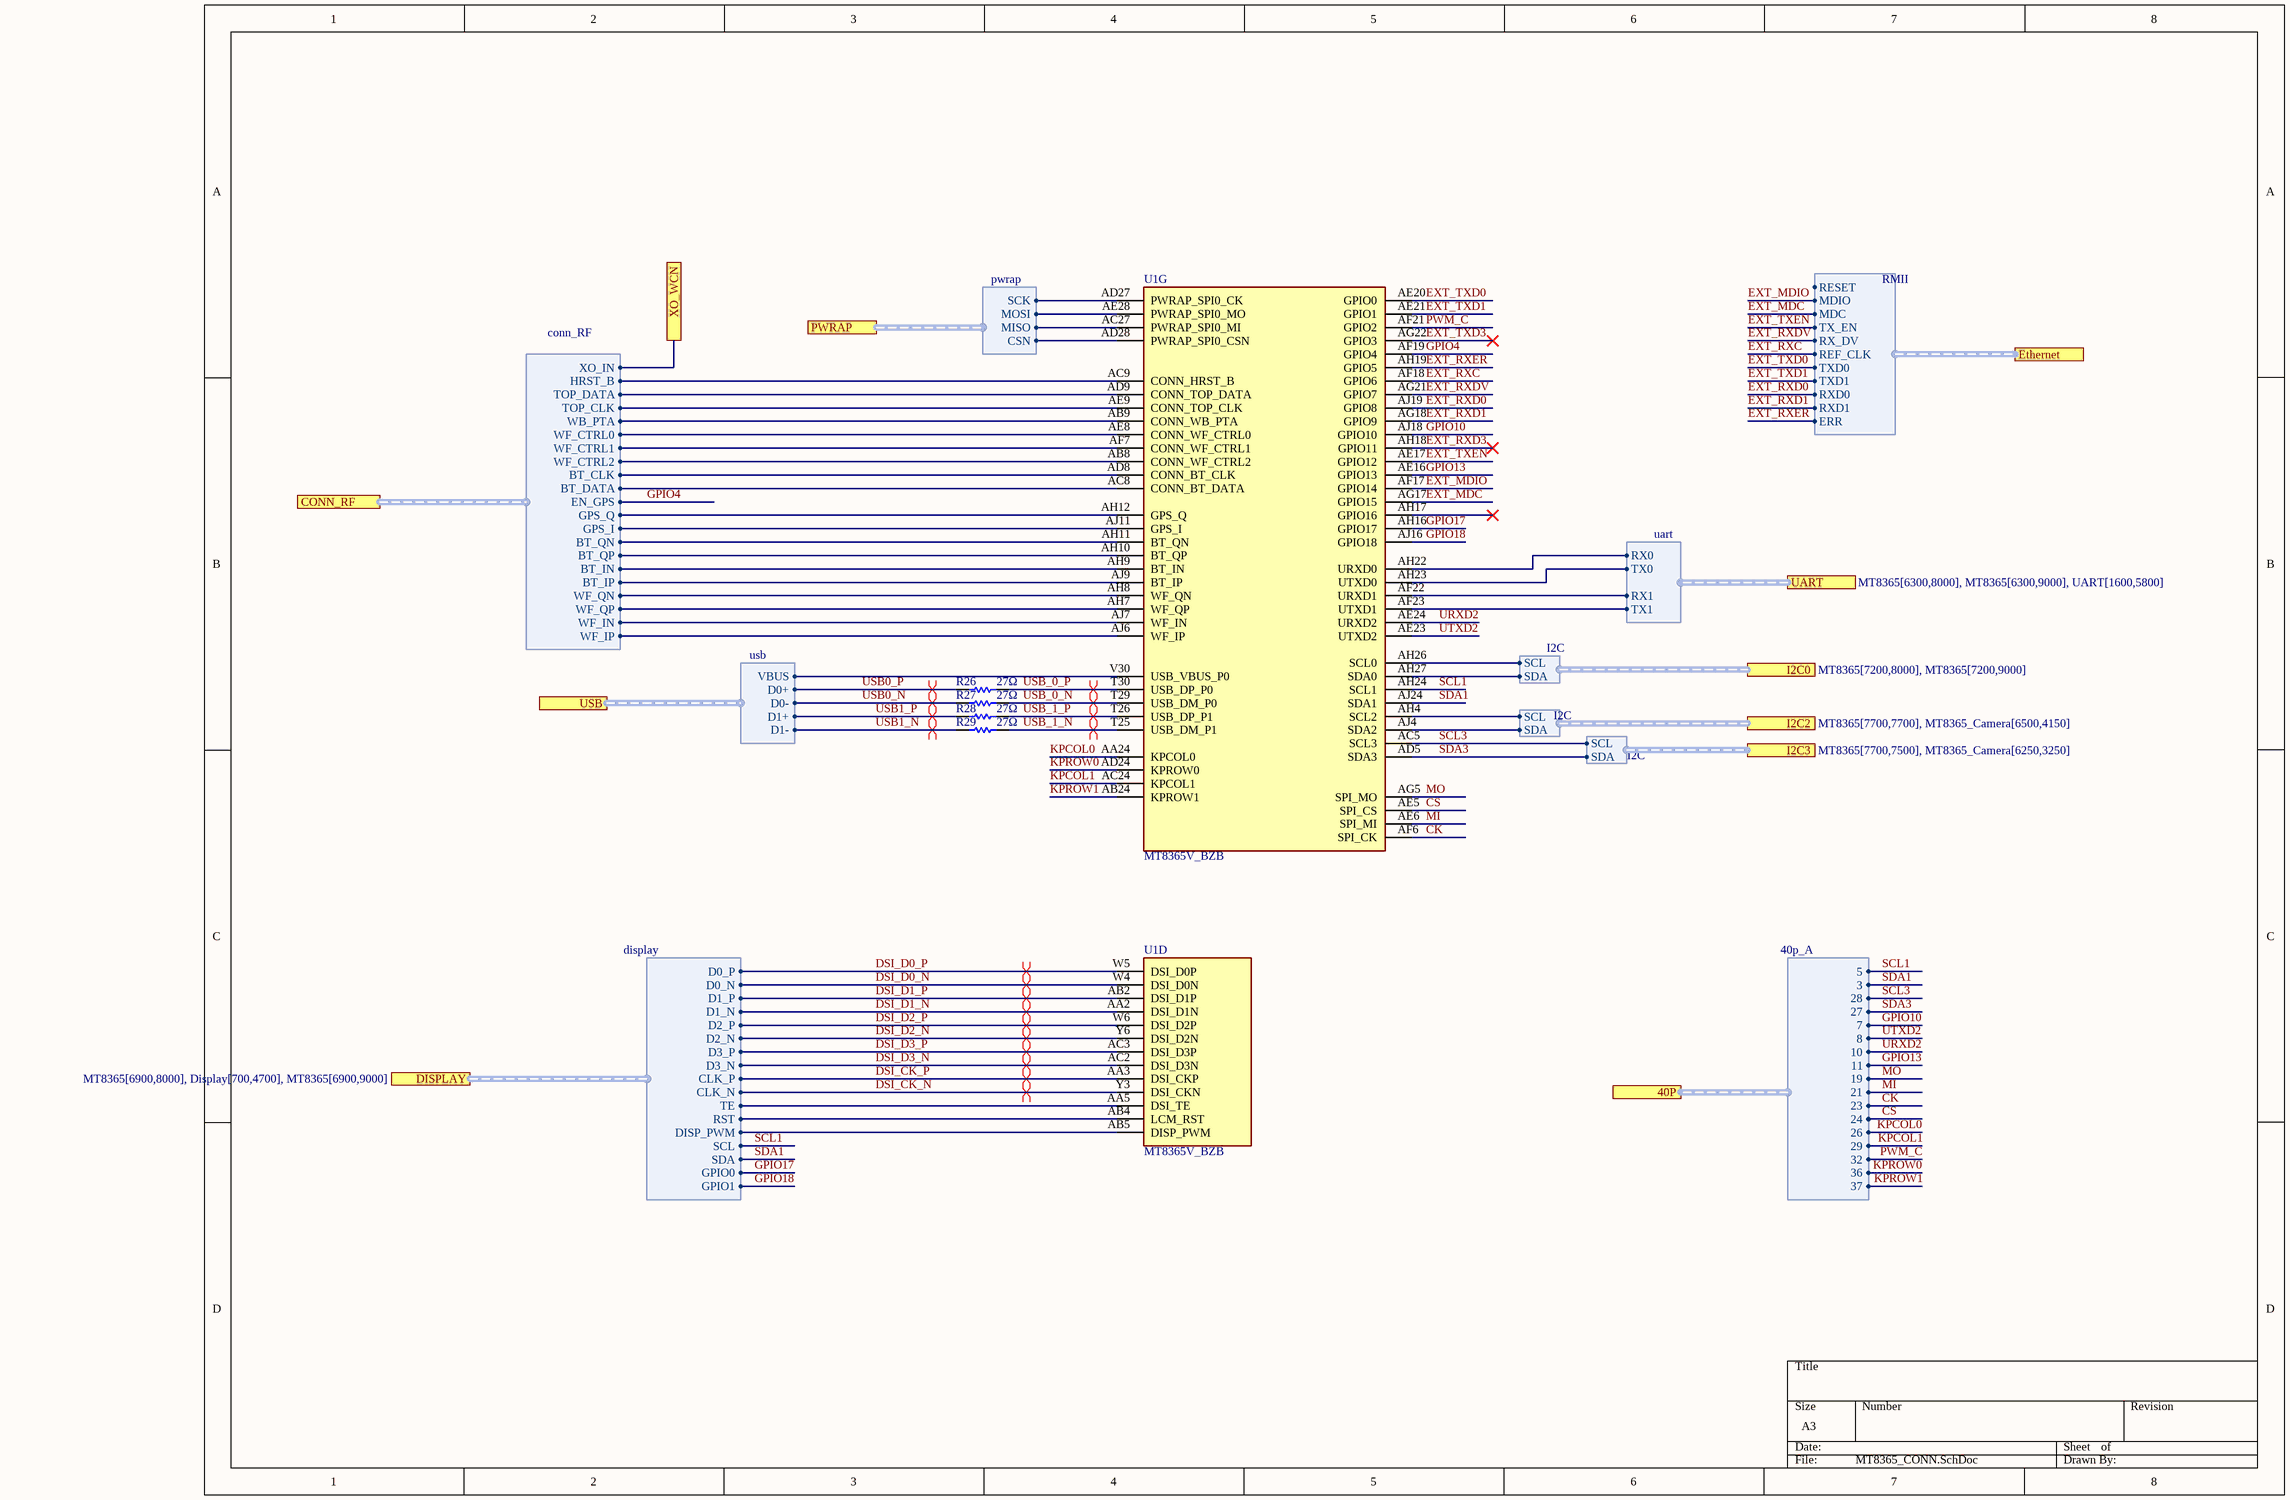
[diagram p5: MT8365_CONN.SchDoc]

### Parts
(Parts that share a designator on the sheet are numbered #1, #2 ... from top to bottom, then left to right.)
R26  value 27Ω  [R0603]  (hidden comment: R0603)
R27  value 27Ω  [R0603]  (hidden comment: R0603)
R28  value 27Ω  [R0603]  (hidden comment: R0603)
R29  value 27Ω  [R0603]  (hidden comment: R0603)
U1#1  MT8365V_BZB  [BGA633C40P30X29_1220X1180X90]  (part D of 11)
U1#2  MT8365V_BZB  [BGA633C40P30X29_1220X1180X90]  (part G of 10)

### Ports
40P (harness 40p_A, see MT8365[7500,8000], GPIOs[500,5200], MT8365[4600,3000], MT8365[7500,8900], MT8365[10000,5500], MT8365_AUD[3500,5200], MT8365_eMMC[8900,5600]), CONN_RF (harness conn_RF, see MT8365[5700,8000], MT6631[10400,3000], MT8365[5700,9000]), DISPLAY (harness display, see MT8365[6900,8000], Display[700,4700], MT8365[6900,9000]), Ethernet (harness RMII, see MT8365[6000,8000], MT8365[6000,9000], RTL8201F[9500,2400]), I2C0 (harness I2C, see MT8365[7200,8000], MT8365[7200,9000]), I2C2 (harness I2C, see MT8365[7700,7700], MT8365_Camera[6500,4150]), I2C3 (harness I2C, see MT8365[7700,7500], MT8365_Camera[6250,3250]), PWRAP (harness pwrap, see MT8365[5500,8000], Control_Interface[3900,4400], MT8365[5500,9000], Power[9100,9000]), UART (harness uart, see MT8365[6300,8000], MT8365[6300,9000], UART[1600,5800]), USB (harness usb, see MT8365[6600,8000], MT8365[6600,9000], USB[700,4700]), XO_WCN (see MT8365[7700,7300], MT8365_Other[3700,4800])

### Harnesses
pwrap: SCK, MOSI, MISO, CSN
conn_RF: XO_IN, HRST_B, TOP_DATA, TOP_CLK, WB_PTA, WF_CTRL0, WF_CTRL1, WF_CTRL2, BT_CLK, BT_DATA, GPS_Q, GPS_I, BT_QN, BT_QP, BT_IN, BT_IP, WF_QN, WF_QP, WF_IN, WF_IP, EN_GPS
RMII: MDIO, MDC, TX_EN, RX_DV, REF_CLK, TXD0, TXD1, RXD0, RXD1, RESET, ERR
uart: TX0, RX0, TX1, RX1
usb: D0+, D0-, D1+, D1-, VBUS
I2C: SCL, SDA
display: D0_P, D0_N, D1_P, D1_N, D2_P, D2_N, D3_P, D3_N, CLK_P, CLK_N, TE, RST, DISP_PWM, SCL, SDA, GPIO0, GPIO1
40p_A: 7, 8, 10, 11, 19, 21, 23, 24, 26, 29, 32, 36, 37, 5, 3, 28, 27

### Nets
BT_CLK: U1#2.AD8(CONN_BT_CLK) ; port CONN_RF.BT_CLK
BT_DATA: U1#2.AC8(CONN_BT_DATA) ; port CONN_RF.BT_DATA
BT_IN: U1#2.AH9(BT_IN) ; port CONN_RF.BT_IN
BT_IP: U1#2.AJ9(BT_IP) ; port CONN_RF.BT_IP
BT_QN: U1#2.AH11(BT_QN) ; port CONN_RF.BT_QN
BT_QP: U1#2.AH10(BT_QP) ; port CONN_RF.BT_QP
CK: U1#2.AF6(SPI_CK) ; port 40P.23
CS: U1#2.AE5(SPI_CS) ; port 40P.24
detect: U1#2.V30(USB_VBUS_P0) ; port USB.VBUS
DSI_CK_N: U1#1.Y3(DSI_CKN) ; port DISPLAY.CLK_N
DSI_CK_P: U1#1.AA3(DSI_CKP) ; port DISPLAY.CLK_P
DSI_D0_N: U1#1.W4(DSI_D0N) ; port DISPLAY.D0_N
DSI_D0_P: U1#1.W5(DSI_D0P) ; port DISPLAY.D0_P
DSI_D1_N: U1#1.AA2(DSI_D1N) ; port DISPLAY.D1_N
DSI_D1_P: U1#1.AB2(DSI_D1P) ; port DISPLAY.D1_P
DSI_D2_N: U1#1.Y6(DSI_D2N) ; port DISPLAY.D2_N
DSI_D2_P: U1#1.W6(DSI_D2P) ; port DISPLAY.D2_P
DSI_D3_N: U1#1.AC2(DSI_D3N) ; port DISPLAY.D3_N
DSI_D3_P: U1#1.AC3(DSI_D3P) ; port DISPLAY.D3_P
EXT_MDC: U1#2.AG17(GPIO15) ; port Ethernet.MDC
EXT_MDIO: U1#2.AF17(GPIO14) ; port Ethernet.MDIO
EXT_RXC: U1#2.AF18(GPIO6) ; port Ethernet.REF_CLK
EXT_RXD0: U1#2.AJ19(GPIO8) ; port Ethernet.RXD0
EXT_RXD1: U1#2.AG18(GPIO9) ; port Ethernet.RXD1
EXT_RXD3: U1#2.AH18(GPIO11)
EXT_RXDV: U1#2.AG21(GPIO7) ; port Ethernet.RX_DV  [project net CRS/CRS_DV]
EXT_RXER: U1#2.AH19(GPIO5) ; port Ethernet.ERR
EXT_TXD0: U1#2.AE20(GPIO0) ; port Ethernet.TXD0
EXT_TXD1: U1#2.AE21(GPIO1) ; port Ethernet.TXD1
EXT_TXD3: U1#2.AG22(GPIO3)
EXT_TXEN: U1#2.AE17(GPIO12) ; port Ethernet.TX_EN
GPIO4: U1#2.AF19(GPIO4) ; port CONN_RF.EN_GPS  [project net EN_GPS]
GPIO10: U1#2.AJ18(GPIO10) ; port 40P.7
GPIO13: U1#2.AE16(GPIO13) ; port 40P.11
GPIO17: U1#2.AH16(GPIO17) ; port DISPLAY.GPIO0
GPIO18: U1#2.AJ16(GPIO18) ; port DISPLAY.GPIO1
GPS_I: U1#2.AJ11(GPS_I) ; port CONN_RF.GPS_I
GPS_Q: U1#2.AH12(GPS_Q) ; port CONN_RF.GPS_Q
HRST_B: U1#2.AC9(CONN_HRST_B) ; port CONN_RF.HRST_B
KPCOL0: U1#2.AA24(KPCOL0) ; port 40P.26
KPCOL1: U1#2.AC24(KPCOL1) ; port 40P.29
KPROW0: U1#2.AD24(KPROW0) ; port 40P.36
KPROW1: U1#2.AB24(KPROW1) ; port 40P.37
MI: U1#2.AE6(SPI_MI) ; port 40P.21
MO: U1#2.AG5(SPI_MO) ; port 40P.19
PWM_C: U1#2.AF21(GPIO2) ; port 40P.32
SCL1: U1#2.AH24(SCL1) ; port DISPLAY.SCL, port 40P.5  [project net 5]
SCL3: U1#2.AC5(SCL3) ; port I2C3.SCL, port 40P.28  [project net 28]
SDA1: U1#2.AJ24(SDA1) ; port DISPLAY.SDA, port 40P.3  [project net 3]
SDA3: U1#2.AD5(SDA3) ; port I2C3.SDA, port 40P.27  [project net 27]
TOP_CLK: U1#2.AE9(CONN_TOP_CLK) ; port CONN_RF.TOP_CLK
TOP_DATA: U1#2.AD9(CONN_TOP_DATA) ; port CONN_RF.TOP_DATA
URXD2: U1#2.AE24(URXD2) ; port 40P.10
USB0_N: R27.1 ; port USB.D0-
USB0_P: R26.1 ; port USB.D0+
USB1_N: R29.1 ; port USB.D1-
USB1_P: R28.1 ; port USB.D1+
USB_0_N: R27.2 U1#2.T29(USB_DM_P0)
USB_0_P: R26.2 U1#2.T30(USB_DP_P0)
USB_1_N: R29.2 U1#2.T25(USB_DM_P1)
USB_1_P: R28.2 U1#2.T26(USB_DP_P1)
UTXD2: U1#2.AE23(UTXD2) ; port 40P.8
WB_PTA: U1#2.AB9(CONN_WB_PTA) ; port CONN_RF.WB_PTA
WF_CTRL0: U1#2.AE8(CONN_WF_CTRL0) ; port CONN_RF.WF_CTRL0
WF_CTRL1: U1#2.AF7(CONN_WF_CTRL1) ; port CONN_RF.WF_CTRL1
WF_CTRL2: U1#2.AB8(CONN_WF_CTRL2) ; port CONN_RF.WF_CTRL2
WF_IN: U1#2.AJ7(WF_IN) ; port CONN_RF.WF_IN
WF_IP: U1#2.AJ6(WF_IP) ; port CONN_RF.WF_IP
WF_QN: U1#2.AH8(WF_QN) ; port CONN_RF.WF_QN
WF_QP: U1#2.AH7(WF_QP) ; port CONN_RF.WF_QP
XO_IN: port XO_WCN, port CONN_RF.XO_IN
Netj6_24: U1#1.AA5(DSI_TE) ; port DISPLAY.TE
Netj6_25: U1#1.AB4(LCM_RST) ; port DISPLAY.RST
Netj6_26: U1#1.AB5(DISP_PWM) ; port DISPLAY.DISP_PWM
NetR35_1: U1#2.AH26(SCL0) ; port I2C0.SCL
NetR36_1: U1#2.AH27(SDA0) ; port I2C0.SDA
NetU1#2_AC27: U1#2.AC27(PWRAP_SPI0_MI) ; port PWRAP.MISO
NetU1#2_AD27: U1#2.AD27(PWRAP_SPI0_CK) ; port PWRAP.SCK
NetU1#2_AD28: U1#2.AD28(PWRAP_SPI0_CSN) ; port PWRAP.CSN
NetU1#2_AE28: U1#2.AE28(PWRAP_SPI0_MO) ; port PWRAP.MOSI
NetU1#2_AF22: U1#2.AF22(URXD1) ; port UART.RX1
NetU1#2_AF23: U1#2.AF23(UTXD1) ; port UART.TX1
NetU1#2_AH4: U1#2.AH4(SCL2) ; port I2C2.SCL
NetU1#2_AH22: U1#2.AH22(URXD0) ; port UART.RX0
NetU1#2_AH23: U1#2.AH23(UTXD0) ; port UART.TX0
NetU1#2_AJ4: U1#2.AJ4(SDA2) ; port I2C2.SDA

Not connected (* = marked no-connect by the designer): U1#2 AH17(GPIO16)*

### Layout directives
differential pair: DSI_CK_N, DSI_CK_P, DSI_D0_N, DSI_D0_P, DSI_D1_N, DSI_D1_P, DSI_D2_N, DSI_D2_P, DSI_D3_N, DSI_D3_P, USB0_N, USB0_P, USB1_N, USB1_P, USB_0_N, USB_0_P, USB_1_N, USB_1_P

### Library data of the parts
U1#1 = MT8365V_BZB: as U1#1 on sheet MT8365_LPDDR4X; Datasheet Link: https://www.mouser.co.uk/datasheet/2/1074/MT8365_AIoT_Application_Processor_Datasheet_v1_0_2-3106631.pdf; Height: 0.9mm; Mouser Part Number: 840-MT8365V/BZB; Mouser Price/Stock: https://www.mouser.co.uk/ProductDetail/MediaTek/MT8365V-BZB?qs=Jm2GQyTW%2FbjcedX9ugwNWQ%3D%3D
U1#2 = MT8365V_BZB: as U1#2 on sheet MT8365_eMMC; Datasheet Link: https://www.mouser.co.uk/datasheet/2/1074/MT8365_AIoT_Application_Processor_Datasheet_v1_0_2-3106631.pdf; Height: 0.9mm; Mouser Part Number: 840-MT8365V/BZB; Mouser Price/Stock: https://www.mouser.co.uk/ProductDetail/MediaTek/MT8365V-BZB?qs=Jm2GQyTW%2FbjcedX9ugwNWQ%3D%3D

## Sheet MT8365_Ground.SchDoc
size A3; SheetNumber: 10; SheetTotal: 36
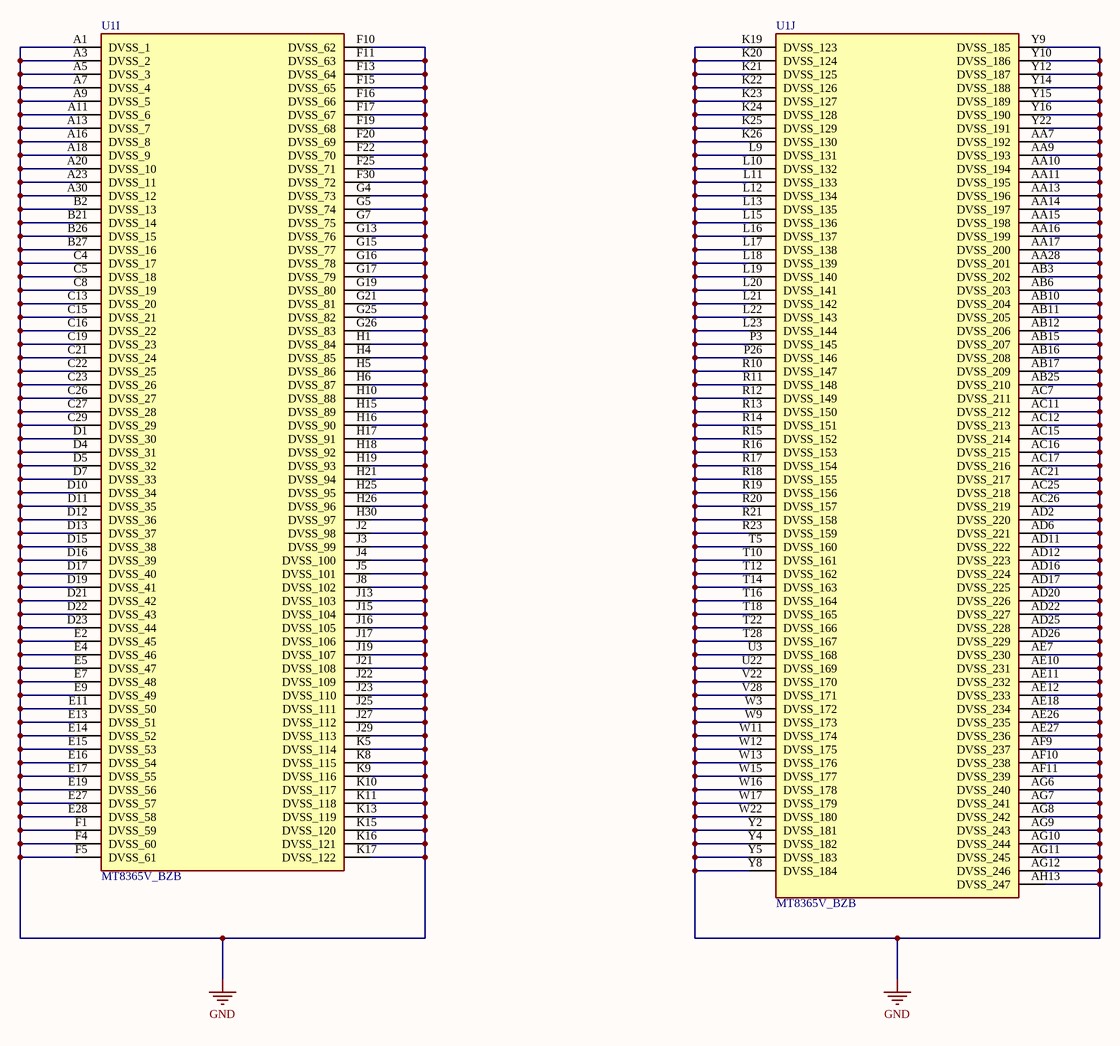
[diagram p6: MT8365_Ground.SchDoc]

### Parts
(Parts that share a designator on the sheet are numbered #1, #2 ... from top to bottom, then left to right.)
U1#2  MT8365V_BZB  [BGA633C40P30X29_1220X1180X90]  (parts I,J of 10)

### Nets
GND: U1#2.A1(DVSS_1) U1#2.A3(DVSS_2) U1#2.A5(DVSS_3) U1#2.A7(DVSS_4) U1#2.A9(DVSS_5) U1#2.A11(DVSS_6) U1#2.A13(DVSS_7) U1#2.A16(DVSS_8) U1#2.A18(DVSS_9) U1#2.A20(DVSS_10) U1#2.A23(DVSS_11) U1#2.A30(DVSS_12) U1#2.AA7(DVSS_192) U1#2.AA9(DVSS_193) U1#2.AA10(DVSS_194) U1#2.AA11(DVSS_195) U1#2.AA13(DVSS_196) U1#2.AA14(DVSS_197) U1#2.AA15(DVSS_198) U1#2.AA16(DVSS_199) U1#2.AA17(DVSS_200) U1#2.AA28(DVSS_201) U1#2.AB3(DVSS_202) U1#2.AB6(DVSS_203) U1#2.AB10(DVSS_204) U1#2.AB11(DVSS_205) U1#2.AB12(DVSS_206) U1#2.AB15(DVSS_207) U1#2.AB16(DVSS_208) U1#2.AB17(DVSS_209) U1#2.AB25(DVSS_210) U1#2.AC7(DVSS_211) U1#2.AC11(DVSS_212) U1#2.AC12(DVSS_213) U1#2.AC15(DVSS_214) U1#2.AC16(DVSS_215) U1#2.AC17(DVSS_216) U1#2.AC21(DVSS_217) U1#2.AC25(DVSS_218) U1#2.AC26(DVSS_219) U1#2.AD2(DVSS_220) U1#2.AD6(DVSS_221) U1#2.AD11(DVSS_222) U1#2.AD12(DVSS_223) U1#2.AD16(DVSS_224) U1#2.AD17(DVSS_225) U1#2.AD20(DVSS_226) U1#2.AD22(DVSS_227) U1#2.AD25(DVSS_228) U1#2.AD26(DVSS_229) U1#2.AE7(DVSS_230) U1#2.AE10(DVSS_231) U1#2.AE11(DVSS_232) U1#2.AE12(DVSS_233) U1#2.AE18(DVSS_234) U1#2.AE26(DVSS_235) U1#2.AE27(DVSS_236) U1#2.AF9(DVSS_237) U1#2.AF10(DVSS_238) U1#2.AF11(DVSS_239) U1#2.AG6(DVSS_240) U1#2.AG7(DVSS_241) U1#2.AG8(DVSS_242) U1#2.AG9(DVSS_243) U1#2.AG10(DVSS_244) U1#2.AG11(DVSS_245) U1#2.AG12(DVSS_246) U1#2.AH13(DVSS_247) U1#2.B2(DVSS_13) U1#2.B21(DVSS_14) U1#2.B26(DVSS_15) U1#2.B27(DVSS_16) U1#2.C4(DVSS_17) U1#2.C5(DVSS_18) U1#2.C8(DVSS_19) U1#2.C13(DVSS_20) U1#2.C15(DVSS_21) U1#2.C16(DVSS_22) U1#2.C19(DVSS_23) U1#2.C21(DVSS_24) U1#2.C22(DVSS_25) U1#2.C23(DVSS_26) U1#2.C26(DVSS_27) U1#2.C27(DVSS_28) U1#2.C29(DVSS_29) U1#2.D1(DVSS_30) U1#2.D4(DVSS_31) U1#2.D5(DVSS_32) U1#2.D7(DVSS_33) U1#2.D10(DVSS_34) U1#2.D11(DVSS_35) U1#2.D12(DVSS_36) U1#2.D13(DVSS_37) U1#2.D15(DVSS_38) U1#2.D16(DVSS_39) U1#2.D17(DVSS_40) U1#2.D19(DVSS_41) U1#2.D21(DVSS_42) U1#2.D22(DVSS_43) U1#2.D23(DVSS_44) U1#2.E2(DVSS_45) U1#2.E4(DVSS_46) U1#2.E5(DVSS_47) U1#2.E7(DVSS_48) U1#2.E9(DVSS_49) U1#2.E11(DVSS_50) U1#2.E13(DVSS_51) U1#2.E14(DVSS_52) U1#2.E15(DVSS_53) U1#2.E16(DVSS_54) U1#2.E17(DVSS_55) U1#2.E19(DVSS_56) U1#2.E27(DVSS_57) U1#2.E28(DVSS_58) U1#2.F1(DVSS_59) U1#2.F4(DVSS_60) U1#2.F5(DVSS_61) U1#2.F10(DVSS_62) U1#2.F11(DVSS_63) U1#2.F13(DVSS_64) U1#2.F15(DVSS_65) U1#2.F16(DVSS_66) U1#2.F17(DVSS_67) U1#2.F19(DVSS_68) U1#2.F20(DVSS_69) U1#2.F22(DVSS_70) U1#2.F25(DVSS_71) U1#2.F30(DVSS_72) U1#2.G4(DVSS_73) U1#2.G5(DVSS_74) U1#2.G7(DVSS_75) U1#2.G13(DVSS_76) U1#2.G15(DVSS_77) U1#2.G16(DVSS_78) U1#2.G17(DVSS_79) U1#2.G19(DVSS_80) U1#2.G21(DVSS_81) U1#2.G25(DVSS_82) U1#2.G26(DVSS_83) U1#2.H1(DVSS_84) U1#2.H4(DVSS_85) U1#2.H5(DVSS_86) U1#2.H6(DVSS_87) U1#2.H10(DVSS_88) U1#2.H15(DVSS_89) U1#2.H16(DVSS_90) U1#2.H17(DVSS_91) U1#2.H18(DVSS_92) U1#2.H19(DVSS_93) U1#2.H21(DVSS_94) U1#2.H25(DVSS_95) U1#2.H26(DVSS_96) U1#2.H30(DVSS_97) U1#2.J2(DVSS_98) U1#2.J3(DVSS_99) U1#2.J4(DVSS_100) U1#2.J5(DVSS_101) U1#2.J8(DVSS_102) U1#2.J13(DVSS_103) U1#2.J15(DVSS_104) U1#2.J16(DVSS_105) U1#2.J17(DVSS_106) U1#2.J19(DVSS_107) U1#2.J21(DVSS_108) U1#2.J22(DVSS_109) U1#2.J23(DVSS_110) U1#2.J25(DVSS_111) U1#2.J27(DVSS_112) U1#2.J29(DVSS_113) U1#2.K5(DVSS_114) U1#2.K8(DVSS_115) U1#2.K9(DVSS_116) U1#2.K10(DVSS_117) U1#2.K11(DVSS_118) U1#2.K13(DVSS_119) U1#2.K15(DVSS_120) U1#2.K16(DVSS_121) U1#2.K17(DVSS_122) U1#2.K19(DVSS_123) U1#2.K20(DVSS_124) U1#2.K21(DVSS_125) U1#2.K22(DVSS_126) U1#2.K23(DVSS_127) U1#2.K24(DVSS_128) U1#2.K25(DVSS_129) U1#2.K26(DVSS_130) U1#2.L9(DVSS_131) U1#2.L10(DVSS_132) U1#2.L11(DVSS_133) U1#2.L12(DVSS_134) U1#2.L13(DVSS_135) U1#2.L15(DVSS_136) U1#2.L16(DVSS_137) U1#2.L17(DVSS_138) U1#2.L18(DVSS_139) U1#2.L19(DVSS_140) U1#2.L20(DVSS_141) U1#2.L21(DVSS_142) U1#2.L22(DVSS_143) U1#2.L23(DVSS_144) U1#2.P3(DVSS_145) U1#2.P26(DVSS_146) U1#2.R10(DVSS_147) U1#2.R11(DVSS_148) U1#2.R12(DVSS_149) U1#2.R13(DVSS_150) U1#2.R14(DVSS_151) U1#2.R15(DVSS_152) U1#2.R16(DVSS_153) U1#2.R17(DVSS_154) U1#2.R18(DVSS_155) U1#2.R19(DVSS_156) U1#2.R20(DVSS_157) U1#2.R21(DVSS_158) U1#2.R23(DVSS_159) U1#2.T5(DVSS_160) U1#2.T10(DVSS_161) U1#2.T12(DVSS_162) U1#2.T14(DVSS_163) U1#2.T16(DVSS_164) U1#2.T18(DVSS_165) U1#2.T22(DVSS_166) U1#2.T28(DVSS_167) U1#2.U3(DVSS_168) U1#2.U22(DVSS_169) U1#2.V22(DVSS_170) U1#2.V28(DVSS_171) U1#2.W3(DVSS_172) U1#2.W9(DVSS_173) U1#2.W11(DVSS_174) U1#2.W12(DVSS_175) U1#2.W13(DVSS_176) U1#2.W15(DVSS_177) U1#2.W16(DVSS_178) U1#2.W17(DVSS_179) U1#2.W22(DVSS_180) U1#2.Y2(DVSS_181) U1#2.Y4(DVSS_182) U1#2.Y5(DVSS_183) U1#2.Y8(DVSS_184) U1#2.Y9(DVSS_185) U1#2.Y10(DVSS_186) U1#2.Y12(DVSS_187) U1#2.Y14(DVSS_188) U1#2.Y15(DVSS_189) U1#2.Y16(DVSS_190) U1#2.Y22(DVSS_191)

### Library data of the parts
U1#2 = MT8365V_BZB: as U1#2 on sheet MT8365_eMMC; Datasheet Link: https://www.mouser.co.uk/datasheet/2/1074/MT8365_AIoT_Application_Processor_Datasheet_v1_0_2-3106631.pdf; Height: 0.9mm; Mouser Part Number: 840-MT8365V/BZB; Mouser Price/Stock: https://www.mouser.co.uk/ProductDetail/MediaTek/MT8365V-BZB?qs=Jm2GQyTW%2FbjcedX9ugwNWQ%3D%3D

## Sheet MT8365_Power.SchDoc
size A3; SheetNumber: 3; SheetTotal: 36
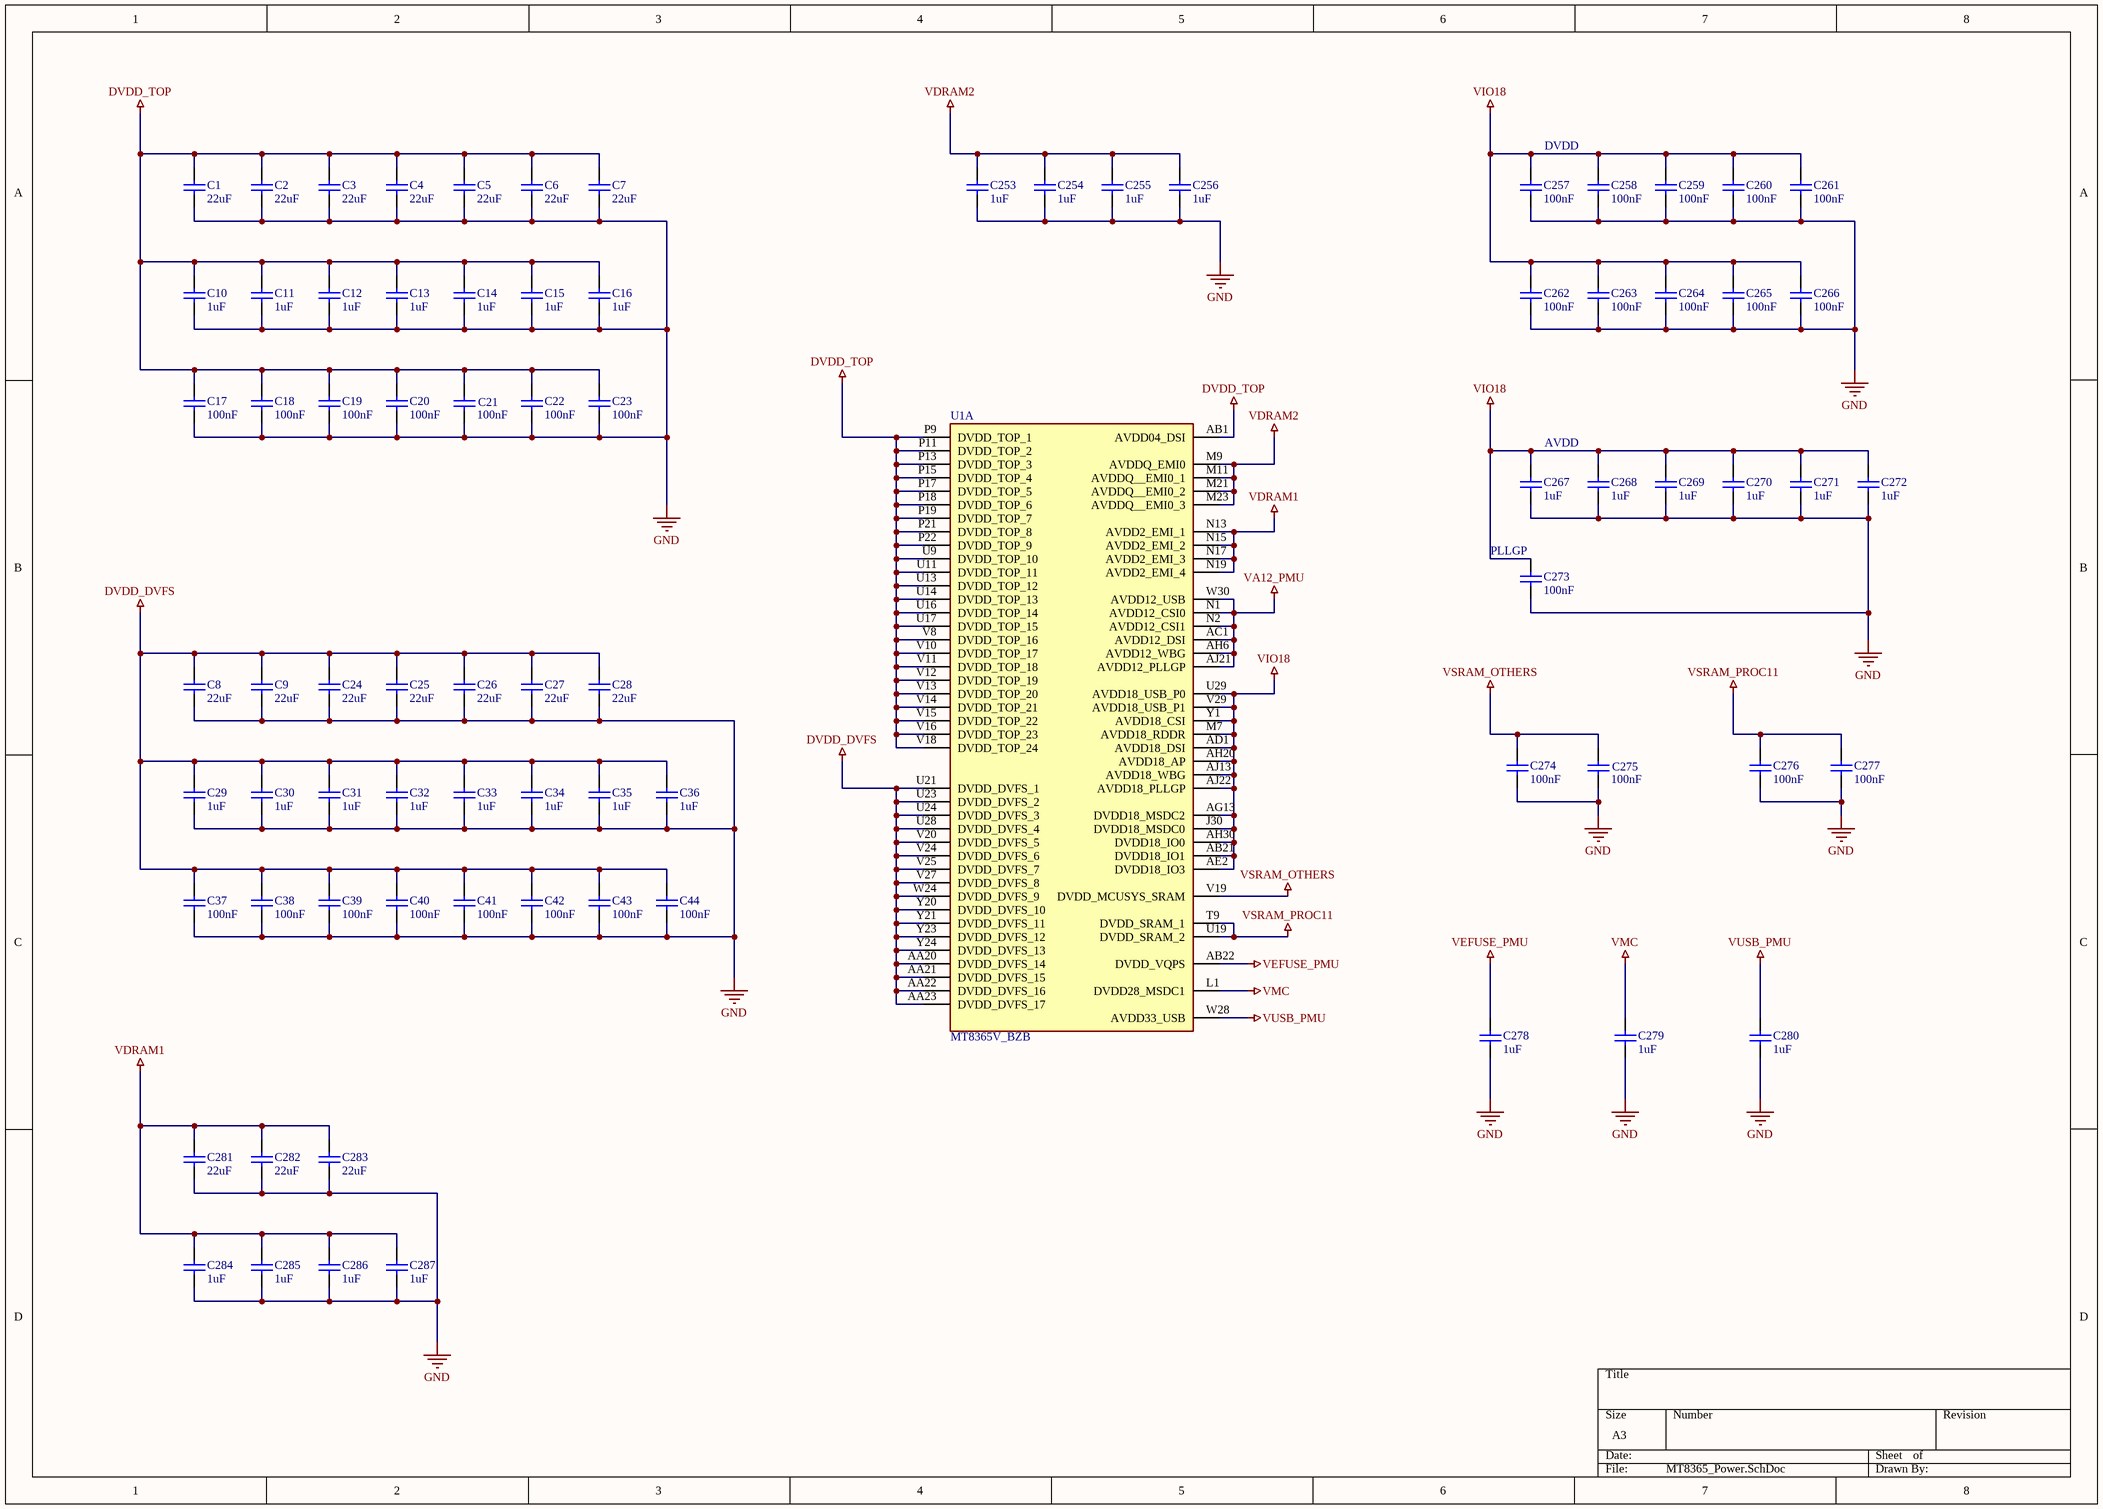
[diagram p7: MT8365_Power.SchDoc]

### Parts
(Parts that share a designator on the sheet are numbered #1, #2 ... from top to bottom, then left to right.)
C1  value 22uF  [C1210]  (hidden comment: C1210)
C2  value 22uF  [C1210]  (hidden comment: C1210)
C3  value 22uF  [C1210]  (hidden comment: C1210)
C4  value 22uF  [C1210]  (hidden comment: C1210)
C5  value 22uF  [C1210]  (hidden comment: C1210)
C6  value 22uF  [C1210]  (hidden comment: C1210)
C7  value 22uF  [C1210]  (hidden comment: C1210)
C8  value 22uF  [C1210]  (hidden comment: C1210)
C9  value 22uF  [C1210]  (hidden comment: C1210)
C10  value 1uF  [C0805]  (hidden comment: C0805)
C11  value 1uF  [C0805]  (hidden comment: C0805)
C12  value 1uF  [C0805]  (hidden comment: C0805)
C13  value 1uF  [C0805]  (hidden comment: C0805)
C14  value 1uF  [C0805]  (hidden comment: C0805)
C15  value 1uF  [C0805]  (hidden comment: C0805)
C16  value 1uF  [C0805]  (hidden comment: C0805)
C17  value 100nF  [C0603]  (hidden comment: C0603)
C18  value 100nF  [C0603]  (hidden comment: C0603)
C19  value 100nF  [C0603]  (hidden comment: C0603)
C20  value 100nF  [C0603]  (hidden comment: C0603)
C21  value 100nF  [C0603]  (hidden comment: C0603)
C22  value 100nF  [C0603]  (hidden comment: C0603)
C23  value 100nF  [C0603]  (hidden comment: C0603)
C24  value 22uF  [C1210]  (hidden comment: C1210)
C25  value 22uF  [C1210]  (hidden comment: C1210)
C26  value 22uF  [C1210]  (hidden comment: C1210)
C27  value 22uF  [C1210]  (hidden comment: C1210)
C28  value 22uF  [C1210]  (hidden comment: C1210)
C29  value 1uF  [C0805]  (hidden comment: C0805)
C30  value 1uF  [C0805]  (hidden comment: C0805)
C31  value 1uF  [C0805]  (hidden comment: C0805)
C32  value 1uF  [C0805]  (hidden comment: C0805)
C33  value 1uF  [C0805]  (hidden comment: C0805)
C34  value 1uF  [C0805]  (hidden comment: C0805)
C35  value 1uF  [C0805]  (hidden comment: C0805)
C36  value 1uF  [C0805]  (hidden comment: C0805)
C37  value 100nF  [C0603]  (hidden comment: C0603)
C38  value 100nF  [C0603]  (hidden comment: C0603)
C39  value 100nF  [C0603]  (hidden comment: C0603)
C40  value 100nF  [C0603]  (hidden comment: C0603)
C41  value 100nF  [C0603]  (hidden comment: C0603)
C42  value 100nF  [C0603]  (hidden comment: C0603)
C43  value 100nF  [C0603]  (hidden comment: C0603)
C44  value 100nF  [C0603]  (hidden comment: C0603)
C253  value 1uF  [C0805]  (hidden comment: C0805)
C254  value 1uF  [C0805]  (hidden comment: C0805)
C255  value 1uF  [C0805]  (hidden comment: C0805)
C256  value 1uF  [C0805]  (hidden comment: C0805)
C257  value 100nF  [C0603]  (hidden comment: C0603)
C258  value 100nF  [C0603]  (hidden comment: C0603)
C259  value 100nF  [C0603]  (hidden comment: C0603)
C260  value 100nF  [C0603]  (hidden comment: C0603)
C261  value 100nF  [C0603]  (hidden comment: C0603)
C262  value 100nF  [C0603]  (hidden comment: C0603)
C263  value 100nF  [C0603]  (hidden comment: C0603)
C264  value 100nF  [C0603]  (hidden comment: C0603)
C265  value 100nF  [C0603]  (hidden comment: C0603)
C266  value 100nF  [C0603]  (hidden comment: C0603)
C267  value 1uF  [C0805]  (hidden comment: C0805)
C268  value 1uF  [C0805]  (hidden comment: C0805)
C269  value 1uF  [C0805]  (hidden comment: C0805)
C270  value 1uF  [C0805]  (hidden comment: C0805)
C271  value 1uF  [C0805]  (hidden comment: C0805)
C272  value 1uF  [C0805]  (hidden comment: C0805)
C273  value 100nF  [C0603]  (hidden comment: C0603)
C274  value 100nF  [C0603]  (hidden comment: C0603)
C275  value 100nF  [C0603]  (hidden comment: C0603)
C276  value 100nF  [C0603]  (hidden comment: C0603)
C277  value 100nF  [C0603]  (hidden comment: C0603)
C278  value 1uF  [C0805]  (hidden comment: C0805)
C279  value 1uF  [C0805]  (hidden comment: C0805)
C280  value 1uF  [C0805]  (hidden comment: C0805)
C281  value 22uF  [C1210]  (hidden comment: C1210)
C282  value 22uF  [C1210]  (hidden comment: C1210)
C283  value 22uF  [C1210]  (hidden comment: C1210)
C284  value 1uF  [C0805]  (hidden comment: C0805)
C285  value 1uF  [C0805]  (hidden comment: C0805)
C286  value 1uF  [C0805]  (hidden comment: C0805)
C287  value 1uF  [C0805]  (hidden comment: C0805)
U1#2  MT8365V_BZB  [BGA633C40P30X29_1220X1180X90]  (part A of 10)

### Nets
DVDD_DVFS: C8.2 C9.2 C24.2 C25.2 C26.2 C27.2 C28.2 C29.2 C30.2 C31.2 C32.2 C33.2 C34.2 C35.2 C36.2 C37.2 C38.2 C39.2 C40.2 C41.2 C42.2 C43.2 C44.2 U1#2.AA20(DVDD_DVFS_14) U1#2.AA21(DVDD_DVFS_15) U1#2.AA22(DVDD_DVFS_16) U1#2.AA23(DVDD_DVFS_17) U1#2.U21(DVDD_DVFS_1) U1#2.U23(DVDD_DVFS_2) U1#2.U24(DVDD_DVFS_3) U1#2.U28(DVDD_DVFS_4) U1#2.V20(DVDD_DVFS_5) U1#2.V24(DVDD_DVFS_6) U1#2.V25(DVDD_DVFS_7) U1#2.V27(DVDD_DVFS_8) U1#2.W24(DVDD_DVFS_9) U1#2.Y20(DVDD_DVFS_10) U1#2.Y21(DVDD_DVFS_11) U1#2.Y23(DVDD_DVFS_12) U1#2.Y24(DVDD_DVFS_13)
DVDD_TOP: C1.2 C2.2 C3.2 C4.2 C5.2 C6.2 C7.2 C10.2 C11.2 C12.2 C13.2 C14.2 C15.2 C16.2 C17.2 C18.2 C19.2 C20.2 C21.2 C22.2 C23.2 U1#2.AB1(AVDD04_DSI) U1#2.P9(DVDD_TOP_1) U1#2.P11(DVDD_TOP_2) U1#2.P13(DVDD_TOP_3) U1#2.P15(DVDD_TOP_4) U1#2.P17(DVDD_TOP_5) U1#2.P18(DVDD_TOP_6) U1#2.P19(DVDD_TOP_7) U1#2.P21(DVDD_TOP_8) U1#2.P22(DVDD_TOP_9) U1#2.U9(DVDD_TOP_10) U1#2.U11(DVDD_TOP_11) U1#2.U13(DVDD_TOP_12) U1#2.U14(DVDD_TOP_13) U1#2.U16(DVDD_TOP_14) U1#2.U17(DVDD_TOP_15) U1#2.V8(DVDD_TOP_16) U1#2.V10(DVDD_TOP_17) U1#2.V11(DVDD_TOP_18) U1#2.V12(DVDD_TOP_19) U1#2.V13(DVDD_TOP_20) U1#2.V14(DVDD_TOP_21) U1#2.V15(DVDD_TOP_22) U1#2.V16(DVDD_TOP_23) U1#2.V18(DVDD_TOP_24)
GND: C1.1 C2.1 C3.1 C4.1 C5.1 C6.1 C7.1 C8.1 C9.1 C10.1 C11.1 C12.1 C13.1 C14.1 C15.1 C16.1 C17.1 C18.1 C19.1 C20.1 C21.1 C22.1 C23.1 C24.1 C25.1 C26.1 C27.1 C28.1 C29.1 C30.1 C31.1 C32.1 C33.1 C34.1 C35.1 C36.1 C37.1 C38.1 C39.1 C40.1 C41.1 C42.1 C43.1 C44.1 C253.1 C254.1 C255.1 C256.1 C257.1 C258.1 C259.1 C260.1 C261.1 C262.1 C263.1 C264.1 C265.1 C266.1 C267.1 C268.1 C269.1 C270.1 C271.1 C272.1 C273.1 C274.1 C275.1 C276.1 C277.1 C278.1 C279.1 C280.1 C281.1 C282.1 C283.1 C284.1 C285.1 C286.1 C287.1
VA12_PMU: U1#2.AC1(AVDD12_DSI) U1#2.AH6(AVDD12_WBG) U1#2.AJ21(AVDD12_PLLGP) U1#2.N1(AVDD12_CSI0) U1#2.N2(AVDD12_CSI1) U1#2.W30(AVDD12_USB)
VDRAM1: C281.2 C282.2 C283.2 C284.2 C285.2 C286.2 C287.2 U1#2.N13(AVDD2_EMI_1) U1#2.N15(AVDD2_EMI_2) U1#2.N17(AVDD2_EMI_3) U1#2.N19(AVDD2_EMI_4)  [project net ODT_CA_a]
VDRAM2: C253.2 C254.2 C255.2 C256.2 U1#2.M9(AVDDQ_EMI0) U1#2.M11(AVDDQ__EMI0_1) U1#2.M21(AVDDQ__EMI0_2) U1#2.M23(AVDDQ__EMI0_3)
VEFUSE_PMU: C278.2 U1#2.AB22(DVDD_VQPS)
VIO18: C257.2 C258.2 C259.2 C260.2 C261.2 C262.2 C263.2 C264.2 C265.2 C266.2 C267.2 C268.2 C269.2 C270.2 C271.2 C272.2 C273.2 U1#2.AB21(DVDD18_IO1) U1#2.AD1(AVDD18_DSI) U1#2.AE2(DVDD18_IO3) U1#2.AG13(DVDD18_MSDC2) U1#2.AH20(AVDD18_AP) U1#2.AH30(DVDD18_IO0) U1#2.AJ13(AVDD18_WBG) U1#2.AJ22(AVDD18_PLLGP) U1#2.J30(DVDD18_MSDC0) U1#2.M7(AVDD18_RDDR) U1#2.U29(AVDD18_USB_P0) U1#2.V29(AVDD18_USB_P1) U1#2.Y1(AVDD18_CSI)
VMC: C279.2 U1#2.L1(DVDD28_MSDC1)
VSRAM_OTHERS: C274.2 C275.2 U1#2.V19(DVDD_MCUSYS_SRAM)
VSRAM_PROC11: C276.2 C277.2 U1#2.T9(DVDD_SRAM_1) U1#2.U19(DVDD_SRAM_2)
VUSB_PMU: C280.2 U1#2.W28(AVDD33_USB)

### Notes on the sheet
- DVDD
- AVDD
- (near C273) PLLGP

### Library data of the parts
U1#2 = MT8365V_BZB: as U1#2 on sheet MT8365_eMMC; Datasheet Link: https://www.mouser.co.uk/datasheet/2/1074/MT8365_AIoT_Application_Processor_Datasheet_v1_0_2-3106631.pdf; Height: 0.9mm; Mouser Part Number: 840-MT8365V/BZB; Mouser Price/Stock: https://www.mouser.co.uk/ProductDetail/MediaTek/MT8365V-BZB?qs=Jm2GQyTW%2FbjcedX9ugwNWQ%3D%3D

## Sheet MT8365_AUD.SchDoc
size A4; SheetNumber: 7; SheetTotal: 36
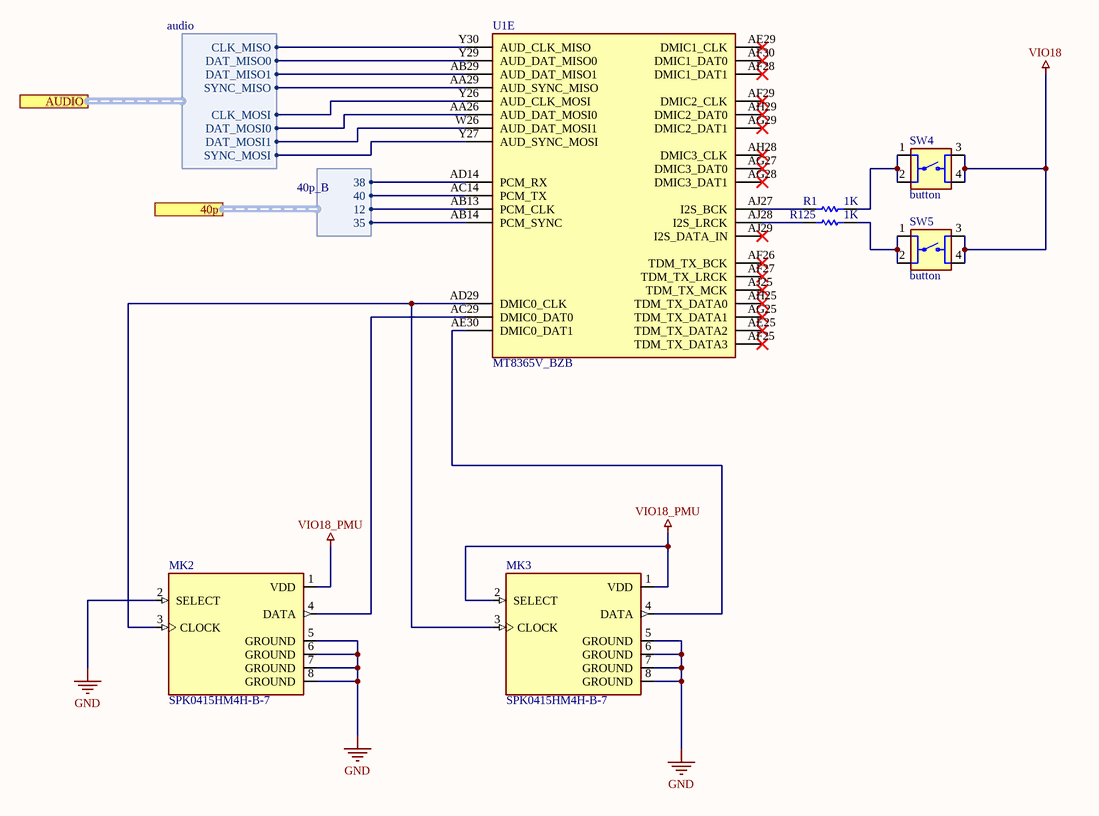
[diagram p8: MT8365_AUD.SchDoc]

### Parts
(Parts that share a designator on the sheet are numbered #1, #2 ... from top to bottom, then left to right.)
MK2  SPK0415HM4H-B-7  [MIC_SPK0415HM4H-B-7]
MK3  SPK0415HM4H-B-7  [MIC_SPK0415HM4H-B-7]
R1  value 1K  [R0603]  (hidden comment: R0603)
R125  value 1K  [R0603]  (hidden comment: R0603)
SW4  button  [BUTTON]
SW5  button  [BUTTON]
U1#1  MT8365V_BZB  [BGA633C40P30X29_1220X1180X90]  (part E of 11)

### Ports
40p (harness 40p_B, see MT8365[9500,5500], GPIOs[500,5200], MT8365[4600,3000], MT8365[7500,8900], MT8365[10000,5500], MT8365_CONN[10500,3000], MT8365_eMMC[8900,5600]), AUDIO (harness audio, see MT8365[9500,5800], AU[6600,8200], MT8365[10000,5800], Power[5400,3900])

### Harnesses
audio: CLK_MISO, DAT_MISO0, DAT_MISO1, SYNC_MISO, CLK_MOSI, DAT_MOSI0, DAT_MOSI1, SYNC_MOSI
40p_B: 12, 35, 38, 40

### Nets
GND: MK2.2(SELECT) MK2.5(GROUND) MK2.6(GROUND) MK2.7(GROUND) MK2.8(GROUND) MK3.5(GROUND) MK3.6(GROUND) MK3.7(GROUND) MK3.8(GROUND)
VIO18: SW4.3 SW4.4 SW5.3 SW5.4
VIO18_PMU: MK2.1(VDD) MK3.1(VDD) MK3.2(SELECT)
NetMK2_3: MK2.3(CLOCK) MK3.3(CLOCK) U1#1.AD29(DMIC0_CLK)
NetMK2_4: MK2.4(DATA) U1#1.AC29(DMIC0_DAT0)
NetMK3_4: MK3.4(DATA) U1#1.AE30(DMIC0_DAT1)
NetR1_1: R1.1 U1#1.AJ27(I2S_BCK)
NetR1_2: R1.2 SW4.1 SW4.2
NetR125_1: R125.1 U1#1.AJ28(I2S_LRCK)
NetR125_2: R125.2 SW5.1 SW5.2
NetU1#1_AA26: U1#1.AA26(AUD_DAT_MOSI0) ; port AUDIO.DAT_MOSI0
NetU1#1_AA29: U1#1.AA29(AUD_SYNC_MISO) ; port AUDIO.SYNC_MISO
NetU1#1_AB13: U1#1.AB13(PCM_CLK) ; port 40p.12
NetU1#1_AB14: U1#1.AB14(PCM_SYNC) ; port 40p.35
NetU1#1_AB29: U1#1.AB29(AUD_DAT_MISO1) ; port AUDIO.DAT_MISO1
NetU1#1_AC14: U1#1.AC14(PCM_TX) ; port 40p.40
NetU1#1_AD14: U1#1.AD14(PCM_RX) ; port 40p.38
NetU1#1_W26: U1#1.W26(AUD_DAT_MOSI1) ; port AUDIO.DAT_MOSI1
NetU1#1_Y26: U1#1.Y26(AUD_CLK_MOSI) ; port AUDIO.CLK_MOSI
NetU1#1_Y27: U1#1.Y27(AUD_SYNC_MOSI) ; port AUDIO.SYNC_MOSI
NetU1#1_Y29: U1#1.Y29(AUD_DAT_MISO0) ; port AUDIO.DAT_MISO0
NetU1#1_Y30: U1#1.Y30(AUD_CLK_MISO) ; port AUDIO.CLK_MISO

Not connected (* = marked no-connect by the designer): U1#1 AE25(TDM_TX_DATA2)* AE29(DMIC1_CLK)* AF25(TDM_TX_DATA3)* AF26(TDM_TX_BCK)* AF27(TDM_TX_LRCK)* AF28(DMIC1_DAT1)* AF29(DMIC2_CLK)* AF30(DMIC1_DAT0)* AG25(TDM_TX_DATA1)* AG27(DMIC3_DAT0)* AG28(DMIC3_DAT1)* AG29(DMIC2_DAT1)* AH25(TDM_TX_DATA0)* AH28(DMIC3_CLK)* AH29(DMIC2_DAT0)* AJ25(TDM_TX_MCK)* AJ29(I2S_DATA_IN)*

### Library data of the parts
MK2 MK3 = SPK0415HM4H-B-7: 100Hz ~ 10kHz Digital, PDM Microphone MEMS _Silicon_ 1.6V ~ 3.6V Omnidirectional _-26dB Â±3dB @ 94dB SPL_ Solder Pads
SW4 SW5 = button: 6x6 mm
U1#1 = MT8365V_BZB: as U1#2 on sheet MT8365_eMMC; Datasheet Link: https://www.mouser.co.uk/datasheet/2/1074/MT8365_AIoT_Application_Processor_Datasheet_v1_0_2-3106631.pdf; Height: 0.9mm; Mouser Part Number: 840-MT8365V/BZB; Mouser Price/Stock: https://www.mouser.co.uk/ProductDetail/MediaTek/MT8365V-BZB?qs=Jm2GQyTW%2FbjcedX9ugwNWQ%3D%3D

## Sheet MT8365_Other.SchDoc
size A4; SheetNumber: 9; SheetTotal: 36
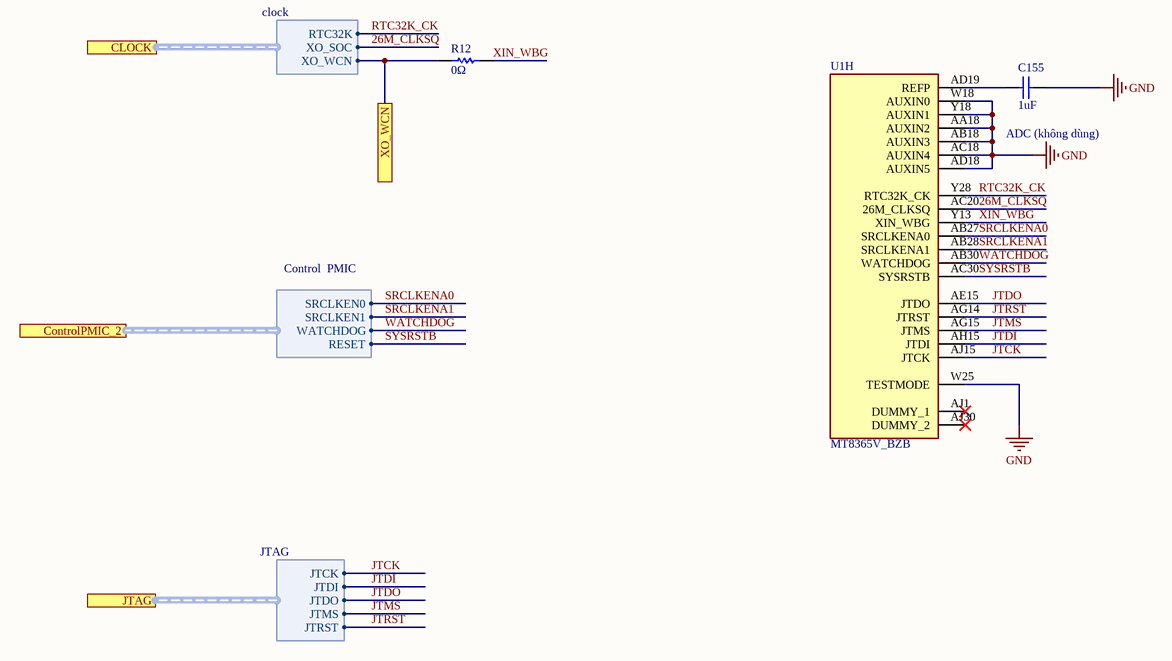
[diagram p9: MT8365_Other.SchDoc]

### Parts
(Parts that share a designator on the sheet are numbered #1, #2 ... from top to bottom, then left to right.)
C155  value 1uF  [C0805]  (hidden comment: C0805)
R12  value 0Ω  [R0603]  (hidden comment: R0603)
U1#2  MT8365V_BZB  [BGA633C40P30X29_1220X1180X90]  (part H of 10)

### Ports
CLOCK (harness clock, see MT8365[9500,4500], MT8365[11000,4500], Power[11000,5700], RTC_Miscellaneous[2500,1800]), ControlPMIC_2 (harness Control  PMIC, see MT8365[9500,4800], Control_Interface[3100,2200], MT8365[11000,4800], Power[9700,9000]), JTAG (harness JTAG, see MT8365[9500,4200], JTAG_Connector[2000,4100], MT8365[11000,4200]), XO_WCN (see MT8365[8200,4800], MT8365_CONN[3500,8600])

### Harnesses
Control  PMIC: WATCHDOG, SRCLKEN0, SRCLKEN1, RESET
clock: RTC32K, XO_SOC, XO_WCN
JTAG: JTCK, JTDI, JTDO, JTMS, JTRST

### Nets
GND: C155.1 U1#2.AA18(AUXIN2) U1#2.AB18(AUXIN3) U1#2.AC18(AUXIN4) U1#2.AD18(AUXIN5) U1#2.W18(AUXIN0) U1#2.W25(TESTMODE) U1#2.Y18(AUXIN1)
26M_CLKSQ: U1#2.AC20(26M_CLKSQ) ; port CLOCK.XO_SOC
JTCK: U1#2.AJ15(JTCK) ; port JTAG.JTCK
JTDI: U1#2.AH15(JTDI) ; port JTAG.JTDI
JTDO: U1#2.AE15(JTDO) ; port JTAG.JTDO
JTMS: U1#2.AG15(JTMS) ; port JTAG.JTMS
JTRST: U1#2.AG14(JTRST) ; port JTAG.JTRST
RTC32K_CK: U1#2.Y28(RTC32K_CK) ; port CLOCK.RTC32K  [project net RTC]
SRCLKENA0: U1#2.AB27(SRCLKENA0) ; port ControlPMIC_2.SRCLKEN0  [project net SRCLKEN_IN0]
SRCLKENA1: U1#2.AB28(SRCLKENA1) ; port ControlPMIC_2.SRCLKEN1  [project net SRCLKEN_IN1]
SYSRSTB: U1#2.AC30(SYSRSTB) ; port ControlPMIC_2.RESET  [project net reset]
WATCHDOG: U1#2.AB30(WATCHDOG) ; port ControlPMIC_2.WATCHDOG
XIN_WBG: R12.2 U1#2.Y13(XIN_WBG)
XO_IN: R12.1 ; port XO_WCN, port CLOCK.XO_WCN
NetC155_2: C155.2 U1#2.AD19(REFP)

Not connected (* = marked no-connect by the designer): U1#2 AJ1(DUMMY_1)* AJ30(DUMMY_2)*

### Notes on the sheet
- (near C155) ADC (không dùng)

### Library data of the parts
U1#2 = MT8365V_BZB: as U1#2 on sheet MT8365_eMMC; Datasheet Link: https://www.mouser.co.uk/datasheet/2/1074/MT8365_AIoT_Application_Processor_Datasheet_v1_0_2-3106631.pdf; Height: 0.9mm; Mouser Part Number: 840-MT8365V/BZB; Mouser Price/Stock: https://www.mouser.co.uk/ProductDetail/MediaTek/MT8365V-BZB?qs=Jm2GQyTW%2FbjcedX9ugwNWQ%3D%3D

## Sheet LPDDR4X.SchDoc
size A3; SheetNumber: 11; SheetTotal: 35
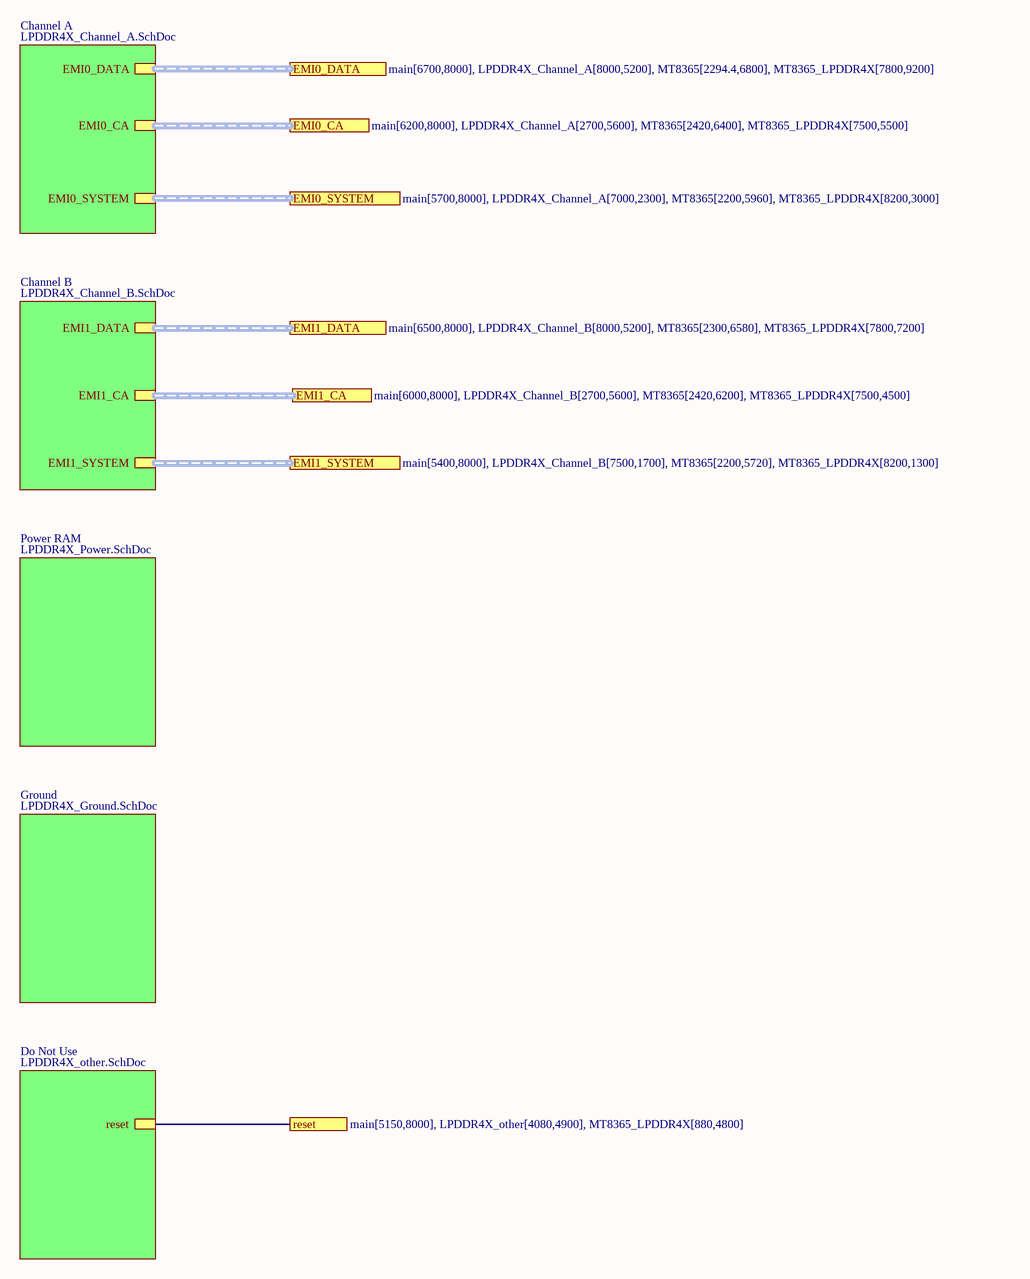
[diagram p10: LPDDR4X.SchDoc]

### Sub-sheets
Channel A = LPDDR4X_Channel_A.SchDoc: EMI0_DATA, EMI0_CA, EMI0_SYSTEM
Channel B = LPDDR4X_Channel_B.SchDoc: EMI1_DATA, EMI1_CA, EMI1_SYSTEM
Do Not Use = LPDDR4X_other.SchDoc: reset
Ground = LPDDR4X_Ground.SchDoc: no entries
Power RAM = LPDDR4X_Power.SchDoc: no entries

### Ports
EMI0_CA (see main[6200,8000], LPDDR4X_Channel_A[2700,5600], MT8365[2420,6400], MT8365_LPDDR4X[7500,5500]), EMI0_DATA (see main[6700,8000], LPDDR4X_Channel_A[8000,5200], MT8365[2294.4,6800], MT8365_LPDDR4X[7800,9200]), EMI0_SYSTEM (see main[5700,8000], LPDDR4X_Channel_A[7000,2300], MT8365[2200,5960], MT8365_LPDDR4X[8200,3000]), EMI1_CA (see main[6000,8000], LPDDR4X_Channel_B[2700,5600], MT8365[2420,6200], MT8365_LPDDR4X[7500,4500]), EMI1_DATA (see main[6500,8000], LPDDR4X_Channel_B[8000,5200], MT8365[2300,6580], MT8365_LPDDR4X[7800,7200]), EMI1_SYSTEM (see main[5400,8000], LPDDR4X_Channel_B[7500,1700], MT8365[2200,5720], MT8365_LPDDR4X[8200,1300]), reset (see main[5150,8000], LPDDR4X_other[4080,4900], MT8365_LPDDR4X[880,4800])

### Nets
NetU1#1_F14: port reset, sheet Do Not Use/reset

### Buses and harness runs
harness port EMI0_CA = sheet Channel A/EMI0_CA
harness port EMI0_DATA = sheet Channel A/EMI0_DATA
harness port EMI0_SYSTEM = sheet Channel A/EMI0_SYSTEM
harness port EMI1_CA = sheet Channel B/EMI1_CA
harness port EMI1_DATA = sheet Channel B/EMI1_DATA
harness port EMI1_SYSTEM = sheet Channel B/EMI1_SYSTEM